# EAGLE schematic quantum_AnalougeEngine_V5_0 (EAGLE 9.5.2)

## Sheet 1 of 12: Voltages
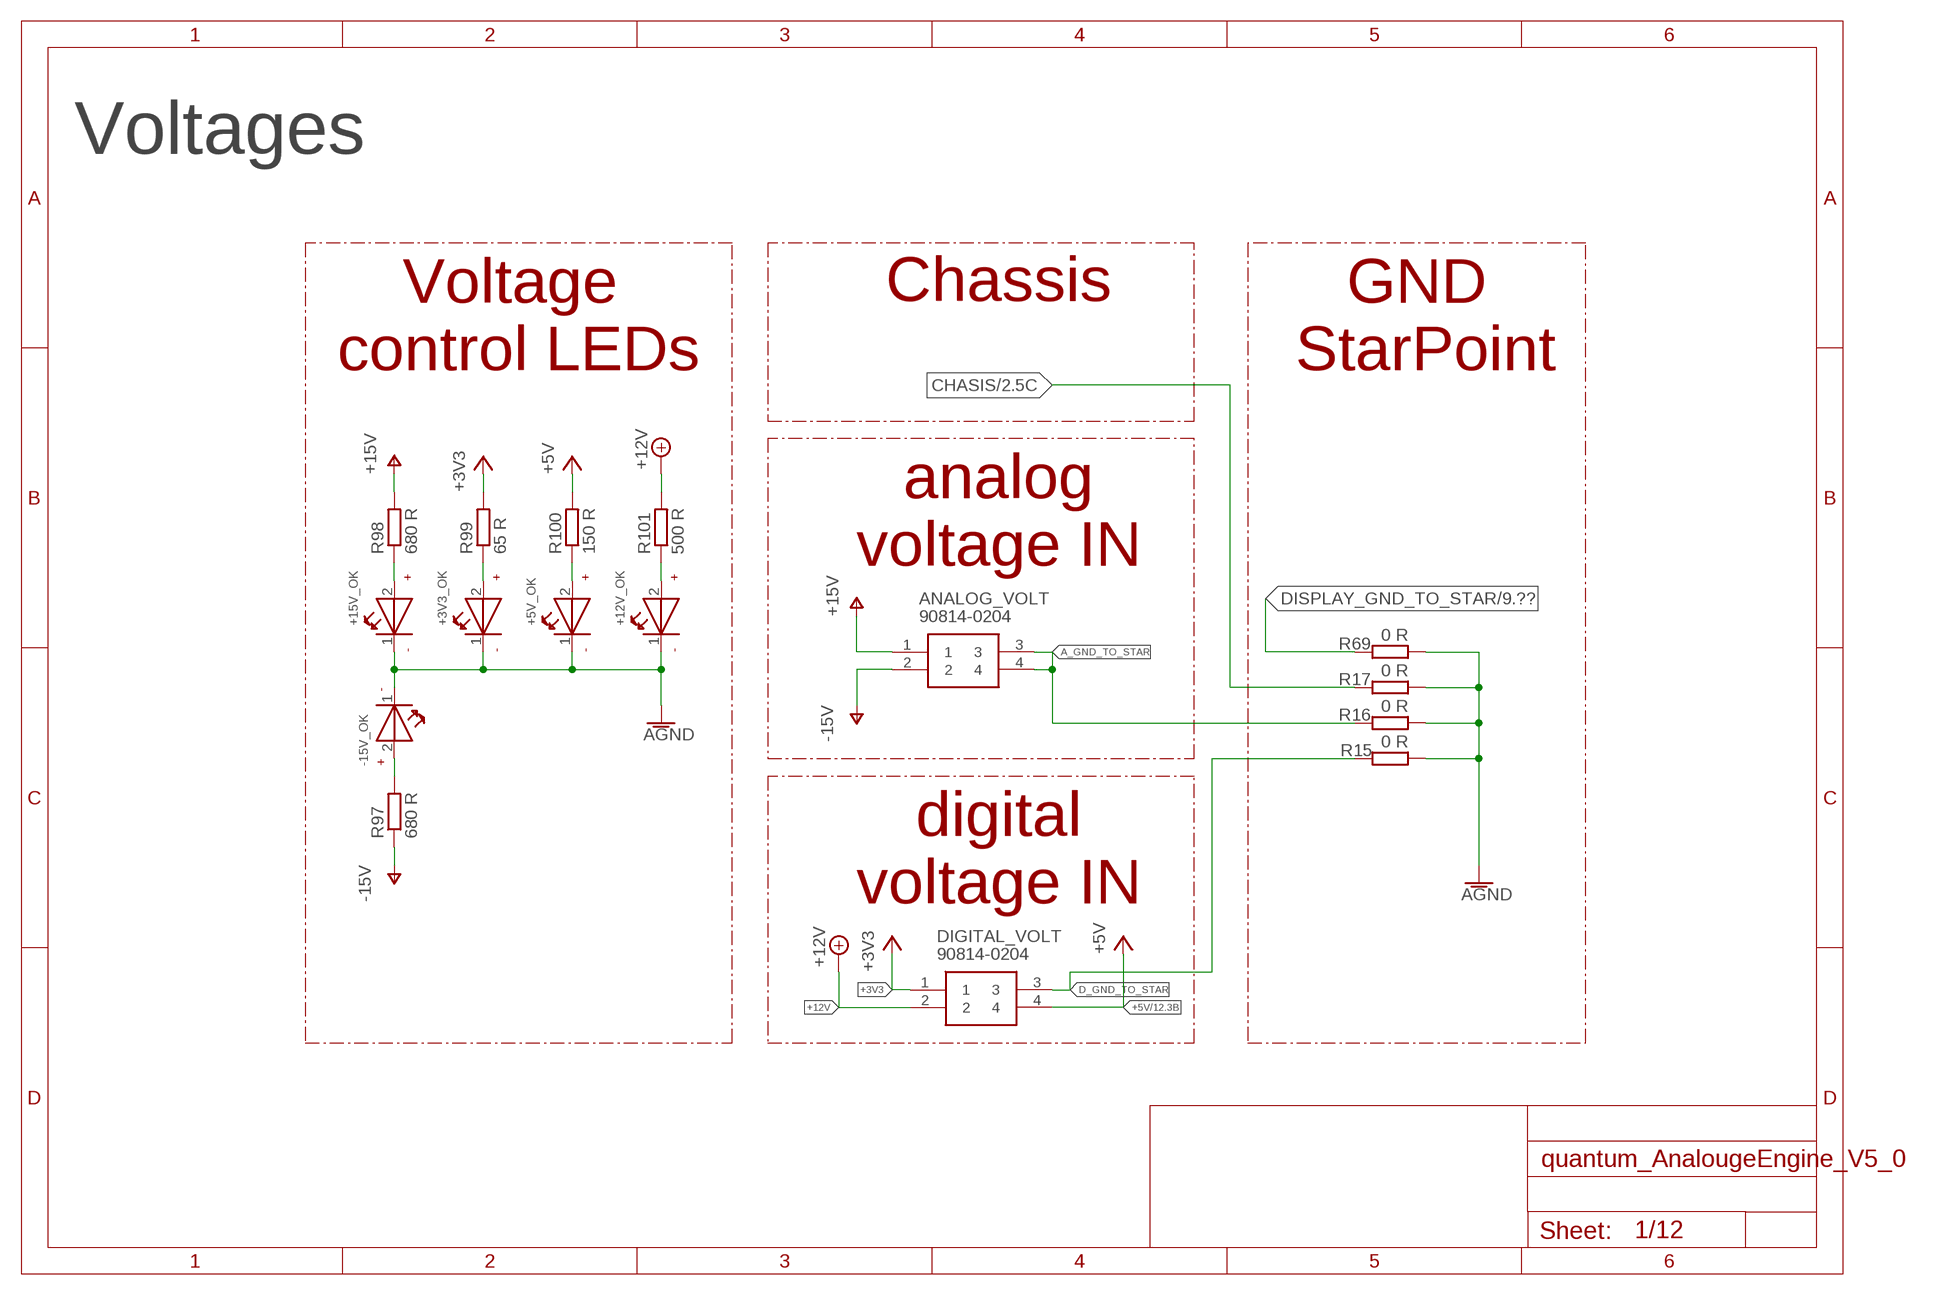
[diagram p0: schematic, sheet 1]

### Parts
+3V3_OK  LED_GREEN_SMD  [WL-SMCW_0603]
+5V_OK  LED_GREEN_SMD  [WL-SMCW_0603]
+12V_OK  LED_GREEN_SMD  [WL-SMCW_0603]
+15V_OK  LED_GREEN_SMD  [WL-SMCW_0603]
-15V_OK  LED_GREEN_SMD  [WL-SMCW_0603]
ANALOG_VOLT  90814-0204  [MOLEX_90814-0204]
DIGITAL_VOLT  90814-0204  [MOLEX_90814-0204]
R15  0 R  RESISTOR_0603  [R0603]
R16  0 R  RESISTOR_0603  [R0603]
R17  0 R  RESISTOR_0603  [R0603]
R69  0 R  RESISTOR_0603  [R0603]
R97  680 R  RESISTOR_0603  [R0603]
R98  680 R  RESISTOR_0603  [R0603]
R99  65 R  RESISTOR_0603  [R0603]
R100  150 R  RESISTOR_0603  [R0603]
R101  500 R  RESISTOR_0603  [R0603]

### Nets
+3V3: DIGITAL_VOLT.1 R99.2 ; also sheet 9,10,11
+5V: DIGITAL_VOLT.4 R100.2 ; also sheet 9,11,12
+12V: DIGITAL_VOLT.2 R101.2 ; also sheet 3,11
A_GND_TO_STAR: ANALOG_VOLT.3 ANALOG_VOLT.4 R16.1
AGND: +3V3_OK.1(-) +5V_OK.1(-) +12V_OK.1(-) +15V_OK.1(-) -15V_OK.1(-) R15.2 R16.2 R17.2 R69.2 ; also sheet 2,3,4,5,6,7,8,9,10,11,12
CHASIS: R17.1 ; also sheet 2,4,9,10
D_GND_TO_STAR: DIGITAL_VOLT.3 R15.1
DISPLAY_GND_TO_STAR: R69.1 ; also sheet 9
N$76: -15V_OK.2(+) R97.2
N$82: +15V_OK.2(+) R98.1
N$83: +3V3_OK.2(+) R99.1
N$84: +5V_OK.2(+) R100.1
N$85: +12V_OK.2(+) R101.1
V+: ANALOG_VOLT.1 R98.2 ; supply symbol labelled +15V ; also sheet 2,4,5,6,7,8,11,12
V-: ANALOG_VOLT.2 R97.1 ; supply symbol labelled -15V ; also sheet 2,4,5,6,7,8,11,12

### Notes on the sheet
- Voltages
- Chassis
- Voltage 
  control LEDs
- GND 
  StarPoint
- analog
  voltage IN
- digital
  voltage IN

## Sheet 2 of 12: Right I/O Section
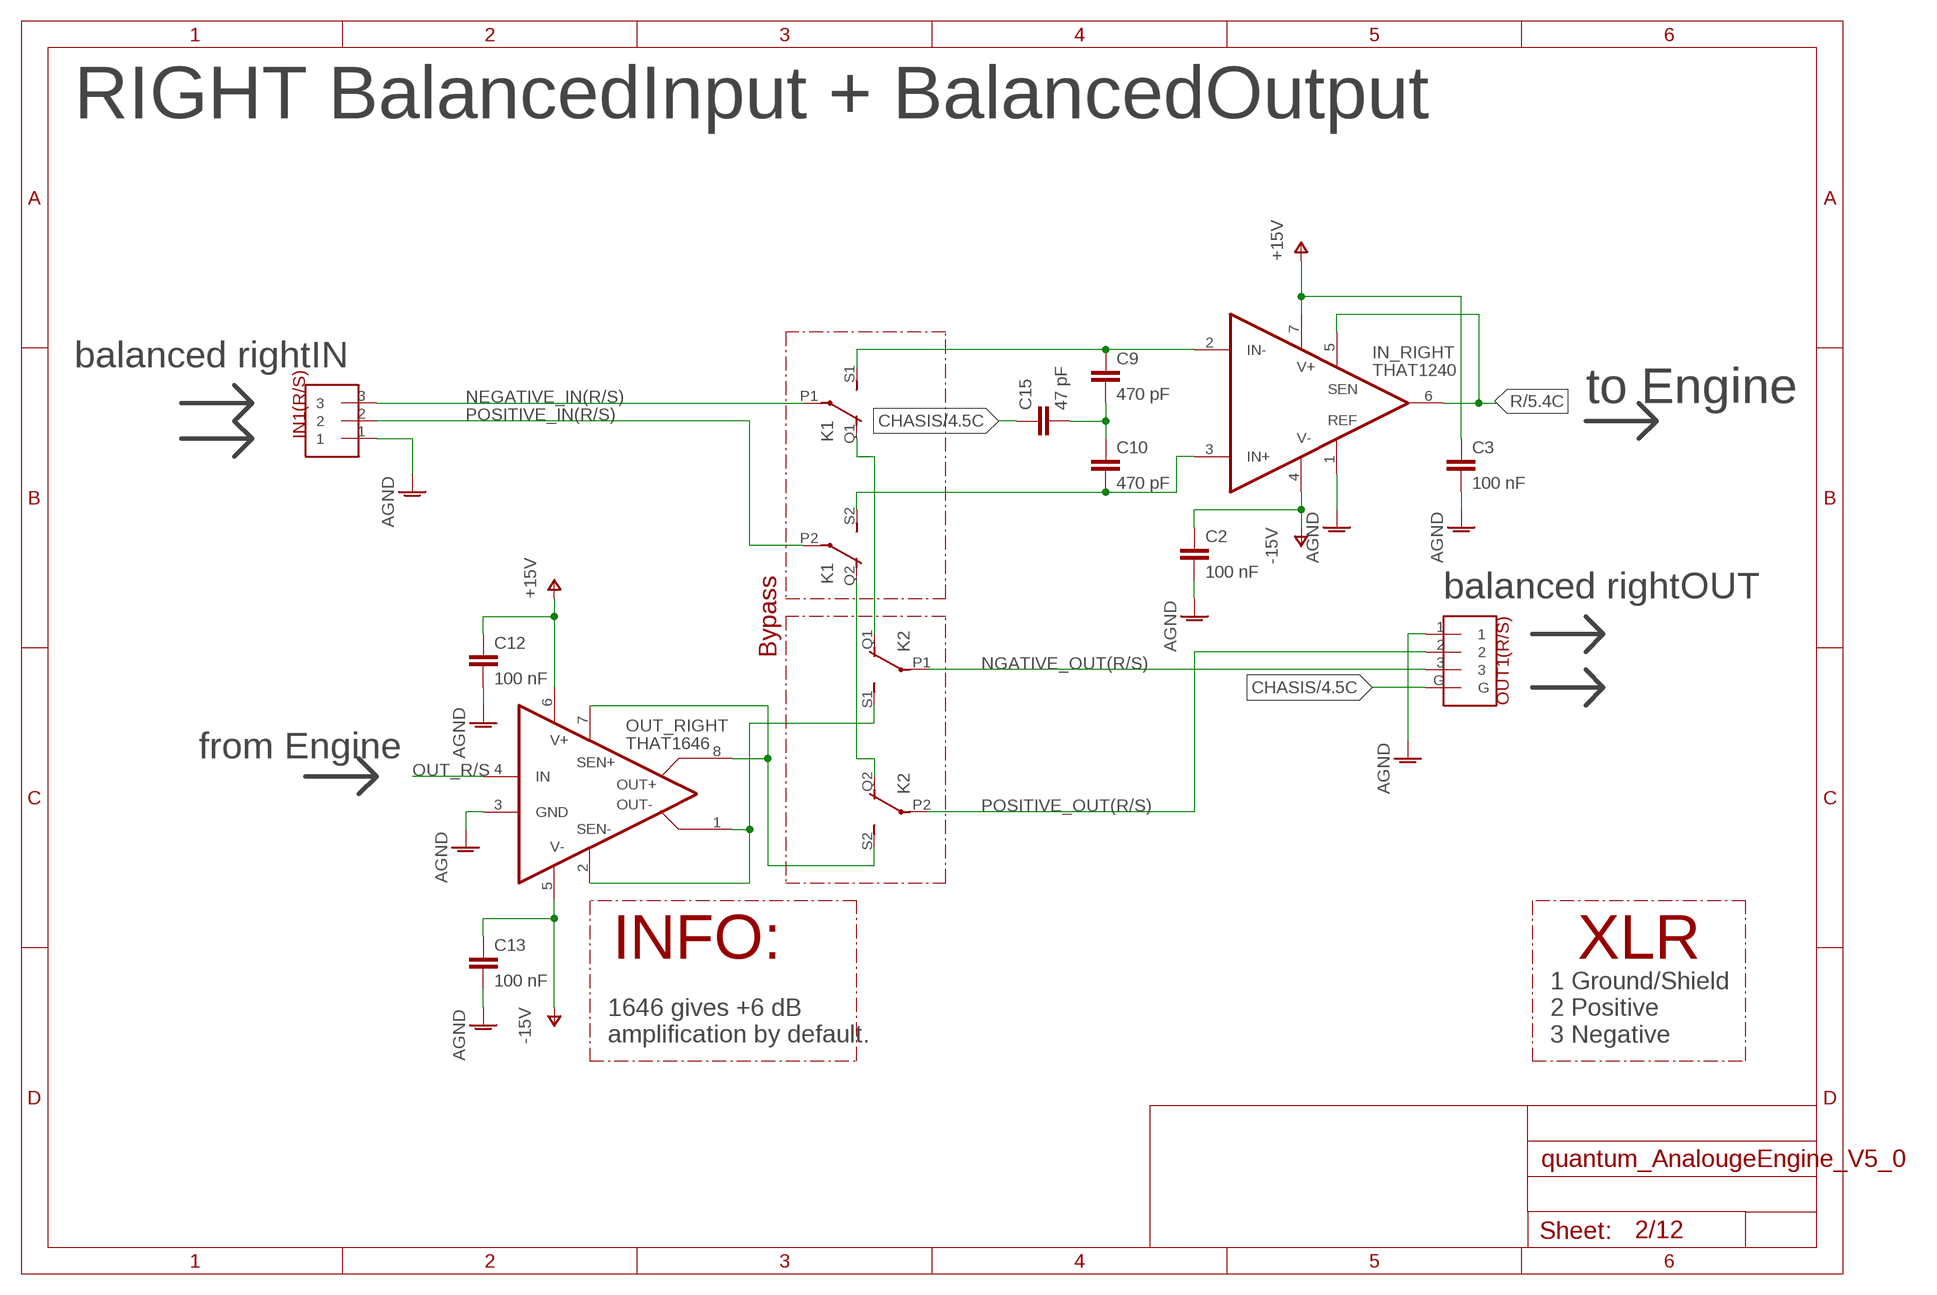
[diagram p1: schematic, sheet 2]

### Parts
C2  100 nF  CAPACITOR_0603  [C0603]
C3  100 nF  CAPACITOR_0603  [C0603]
C9  470 pF  CAPACITOR_0603  [C0603]
C10  470 pF  CAPACITOR_0603  [C0603]
C12  100 nF  CAPACITOR_0603  [C0603]
C13  100 nF  CAPACITOR_0603  [C0603]
C15  47 pF  CAPACITOR_0603  [C0603]
IN1(R/S)  NEUTRIK_NC3FAH  [NEUTRIK_NC3FAH]
IN_RIGHT  THAT1240  THAT1240SO8-USO8-U  [SO08]
K1  Relay  RELAY_EE2-5NU  [351]
K2  Relay  RELAY_EE2-5NU  [351]
OUT1(R/S)  NEUTRIK_NC3MAH  [NEUTRIK_NC3MAH]
OUT_RIGHT  THAT1646  THAT1646SO8-USO8-U  [SO08]

### Nets
AGND: C2.2 C3.2 C12.2 C13.2 IN1(R/S).1 IN_RIGHT.1(REF) OUT1(R/S).1 OUT_RIGHT.3(GND) ; also sheet 1,3,4,5,6,7,8,9,10,11,12
CHASIS: C15.1 OUT1(R/S).G ; also sheet 1,4,9,10
N$1: C9.1 IN_RIGHT.2(IN-) K1.S1(2:S)
N$2: C10.2 IN_RIGHT.3(IN+) K1.S2(3:S)
N$3: C9.2 C10.1 C15.2
N$8: K1.Q1(2:O) K2.Q1(2:O)
N$11: K1.Q2(3:O) K2.Q2(3:O)
NEGATIVE_IN(R/S): IN1(R/S).3 K1.P1(2:P)
NGATIVE_OUT(R/S): K2.P1(2:P) OUT1(R/S).3
OUT_R/S: OUT_RIGHT.4(IN) ; also sheet 8
POSITIVE_IN(R/S): IN1(R/S).2 K1.P2(3:P)
POSITIVE_OUT(R/S): K2.P2(3:P) OUT1(R/S).2
R: IN_RIGHT.5(SEN) IN_RIGHT.6(OUT) ; also sheet 5
R/S_OUT+: K2.S2(3:S) OUT_RIGHT.7(SEN+) OUT_RIGHT.8(OUT+)
R/S_OUT-: K2.S1(2:S) OUT_RIGHT.1(OUT-) OUT_RIGHT.2(SEN-)
V+: C3.1 C12.1 IN_RIGHT.7(V+) OUT_RIGHT.6(V+) ; supply symbol labelled +15V ; also sheet 1,4,5,6,7,8,11,12
V-: C2.1 C13.1 IN_RIGHT.4(V-) OUT_RIGHT.5(V-) ; supply symbol labelled -15V ; also sheet 1,4,5,6,7,8,11,12

### Notes on the sheet
- RIGHT BalancedInput + BalancedOutput
- balanced rightIN
- to Engine
- balanced rightOUT
- Bypass
- from Engine
- INFO: | XLR
- 1646 gives +6 dB 
  amplification by default.
- 1 Ground/Shield
  2 Positive
  3 Negative

## Sheet 3 of 12: Relais
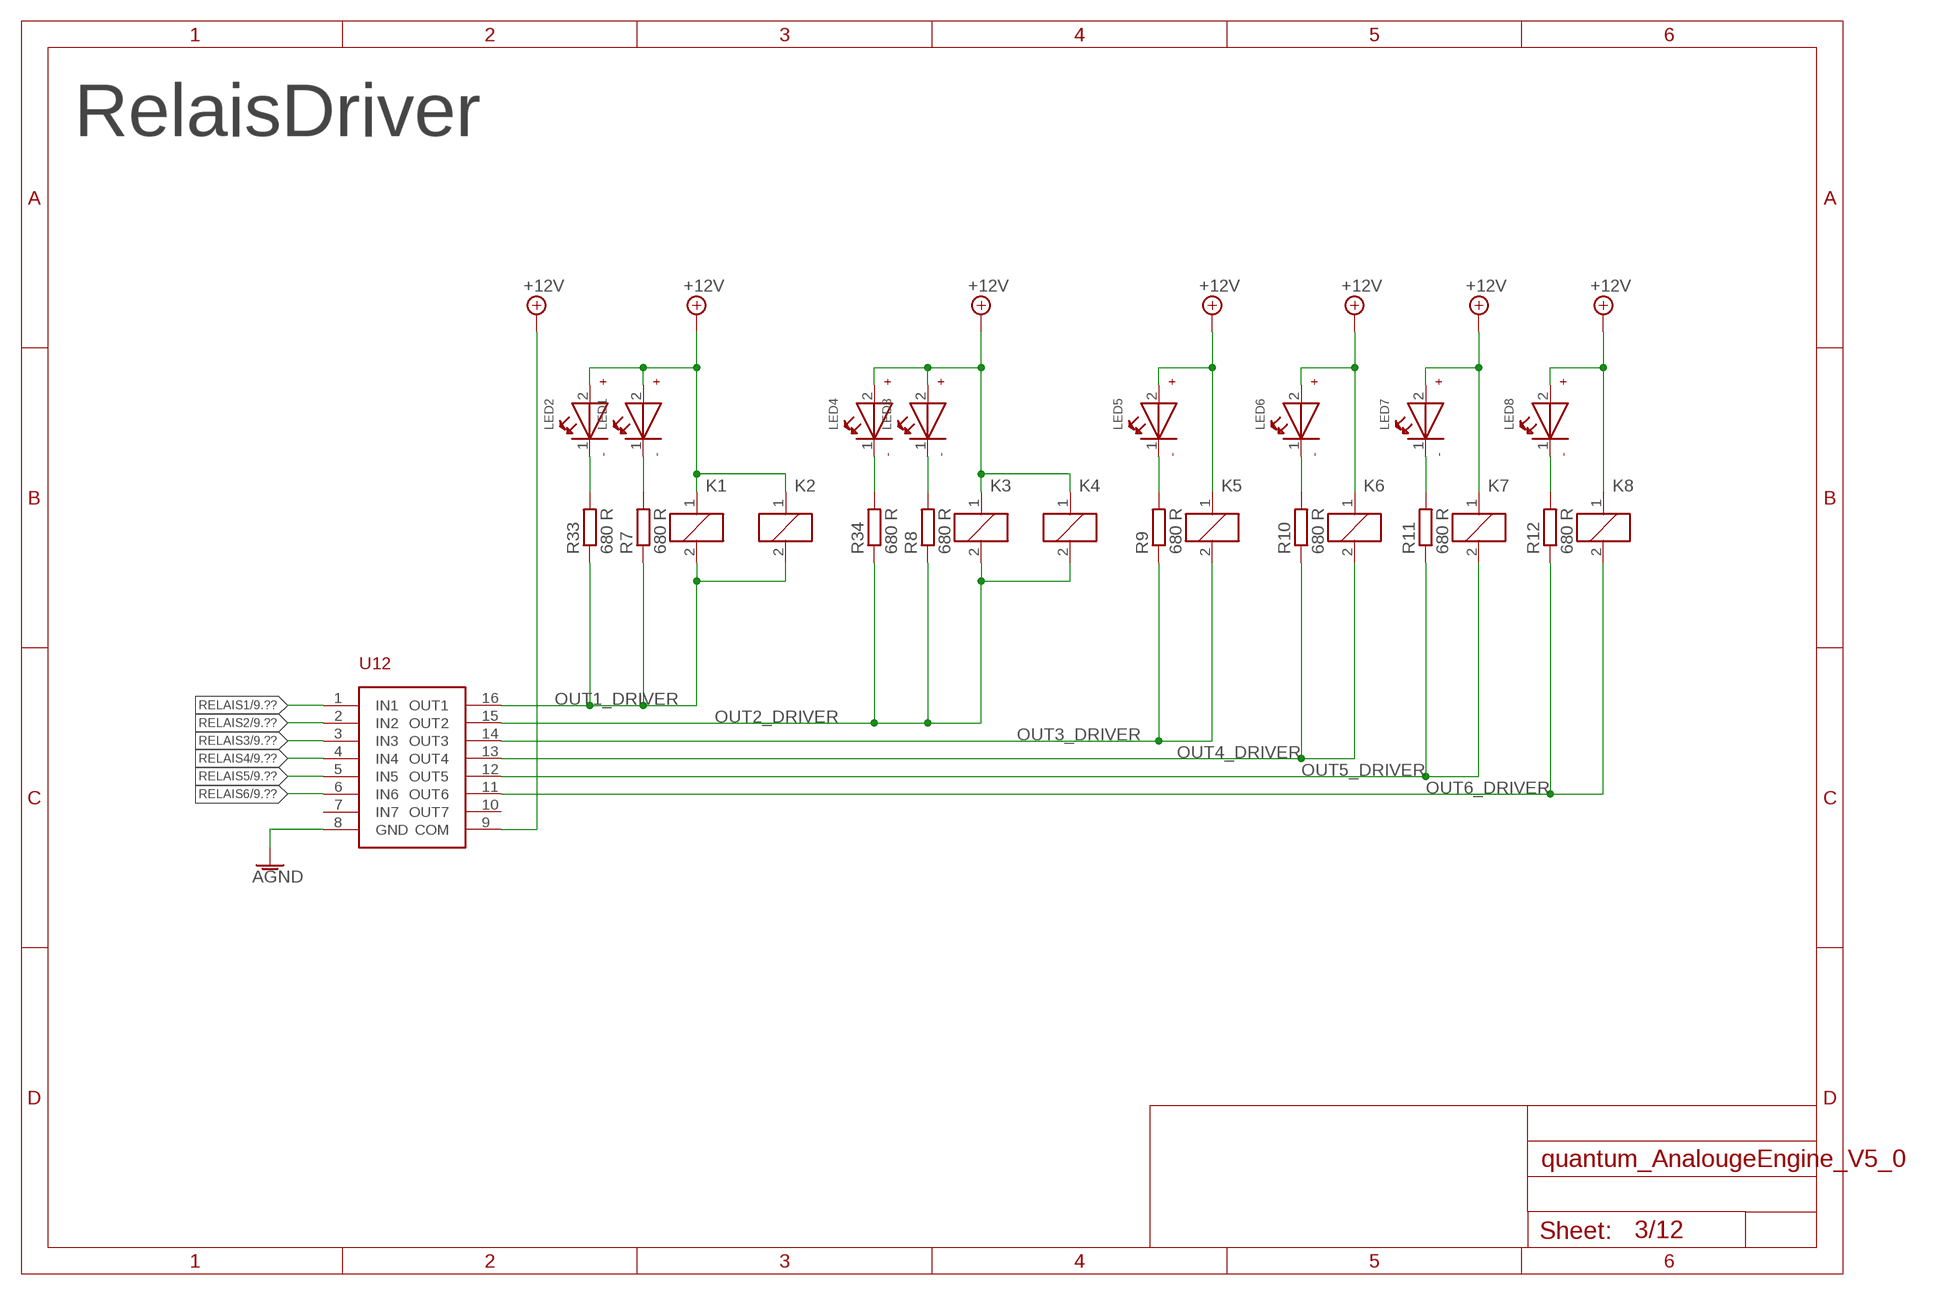
[diagram p2: schematic, sheet 3]

### Parts
K3  Relay  RELAY_EE2-5NU  [351]
K4  Relay  RELAY_EE2-5NU  [351]
K5  Relay  RELAY_EE2-5NU  [351]
K6  Relay  RELAY_EE2-5NU  [351]
K7  Relay  RELAY_EE2-5NU  [351]
K8  Relay  RELAY_EE2-5NU  [351]
LED1  LED_BLUE_SMD  [WL-SMCW_0603]
LED2  LED_BLUE_SMD  [WL-SMCW_0603]
LED3  LED_BLUE_SMD  [WL-SMCW_0603]
LED4  LED_BLUE_SMD  [WL-SMCW_0603]
LED5  LED_BLUE_SMD  [WL-SMCW_0603]
LED6  LED_BLUE_SMD  [WL-SMCW_0603]
LED7  LED_BLUE_SMD  [WL-SMCW_0603]
LED8  LED_BLUE_SMD  [WL-SMCW_0603]
R7  680 R  RESISTOR_0603  [R0603]
R8  680 R  RESISTOR_0603  [R0603]
R9  680 R  RESISTOR_0603  [R0603]
R10  680 R  RESISTOR_0603  [R0603]
R11  680 R  RESISTOR_0603  [R0603]
R12  680 R  RESISTOR_0603  [R0603]
R33  680 R  RESISTOR_0603  [R0603]
R34  680 R  RESISTOR_0603  [R0603]
U12  ULN2003  [SOIC16]

### Nets
+12V: K1.1 K2.1 K3.1 K4.1 K5.1 K6.1 K7.1 K8.1 LED1.2(+) LED2.2(+) LED3.2(+) LED4.2(+) LED5.2(+) LED6.2(+) LED7.2(+) LED8.2(+) U12.9(COM) ; also sheet 1,11
AGND: U12.8(GND) ; also sheet 1,2,4,5,6,7,8,9,10,11,12
N$14: LED1.1(-) R7.2
N$16: LED3.1(-) R8.2
N$26: LED8.1(-) R12.2
N$29: LED7.1(-) R11.2
N$30: LED6.1(-) R10.2
N$32: LED5.1(-) R9.2
N$49: LED2.1(-) R33.2
N$51: LED4.1(-) R34.2
OUT1_DRIVER: K1.2 K2.2 R7.1 R33.1 U12.16(OUT1)
OUT2_DRIVER: K3.2 K4.2 R8.1 R34.1 U12.15(OUT2)
OUT3_DRIVER: K5.2 R9.1 U12.14(OUT3)
OUT4_DRIVER: K6.2 R10.1 U12.13(OUT4)
OUT5_DRIVER: K7.2 R11.1 U12.12(OUT5)
OUT6_DRIVER: K8.2 R12.1 U12.11(OUT6)
RELAIS1: U12.1(IN1) ; also sheet 9
RELAIS2: U12.2(IN2) ; also sheet 9
RELAIS3: U12.3(IN3) ; also sheet 9
RELAIS4: U12.4(IN4) ; also sheet 9
RELAIS5: U12.5(IN5) ; also sheet 9
RELAIS6: U12.6(IN6) ; also sheet 9
Unconnected: U12.7(IN7) U12.10(OUT7)

### Notes on the sheet
- RelaisDriver

## Sheet 4 of 12: Left I/O Section
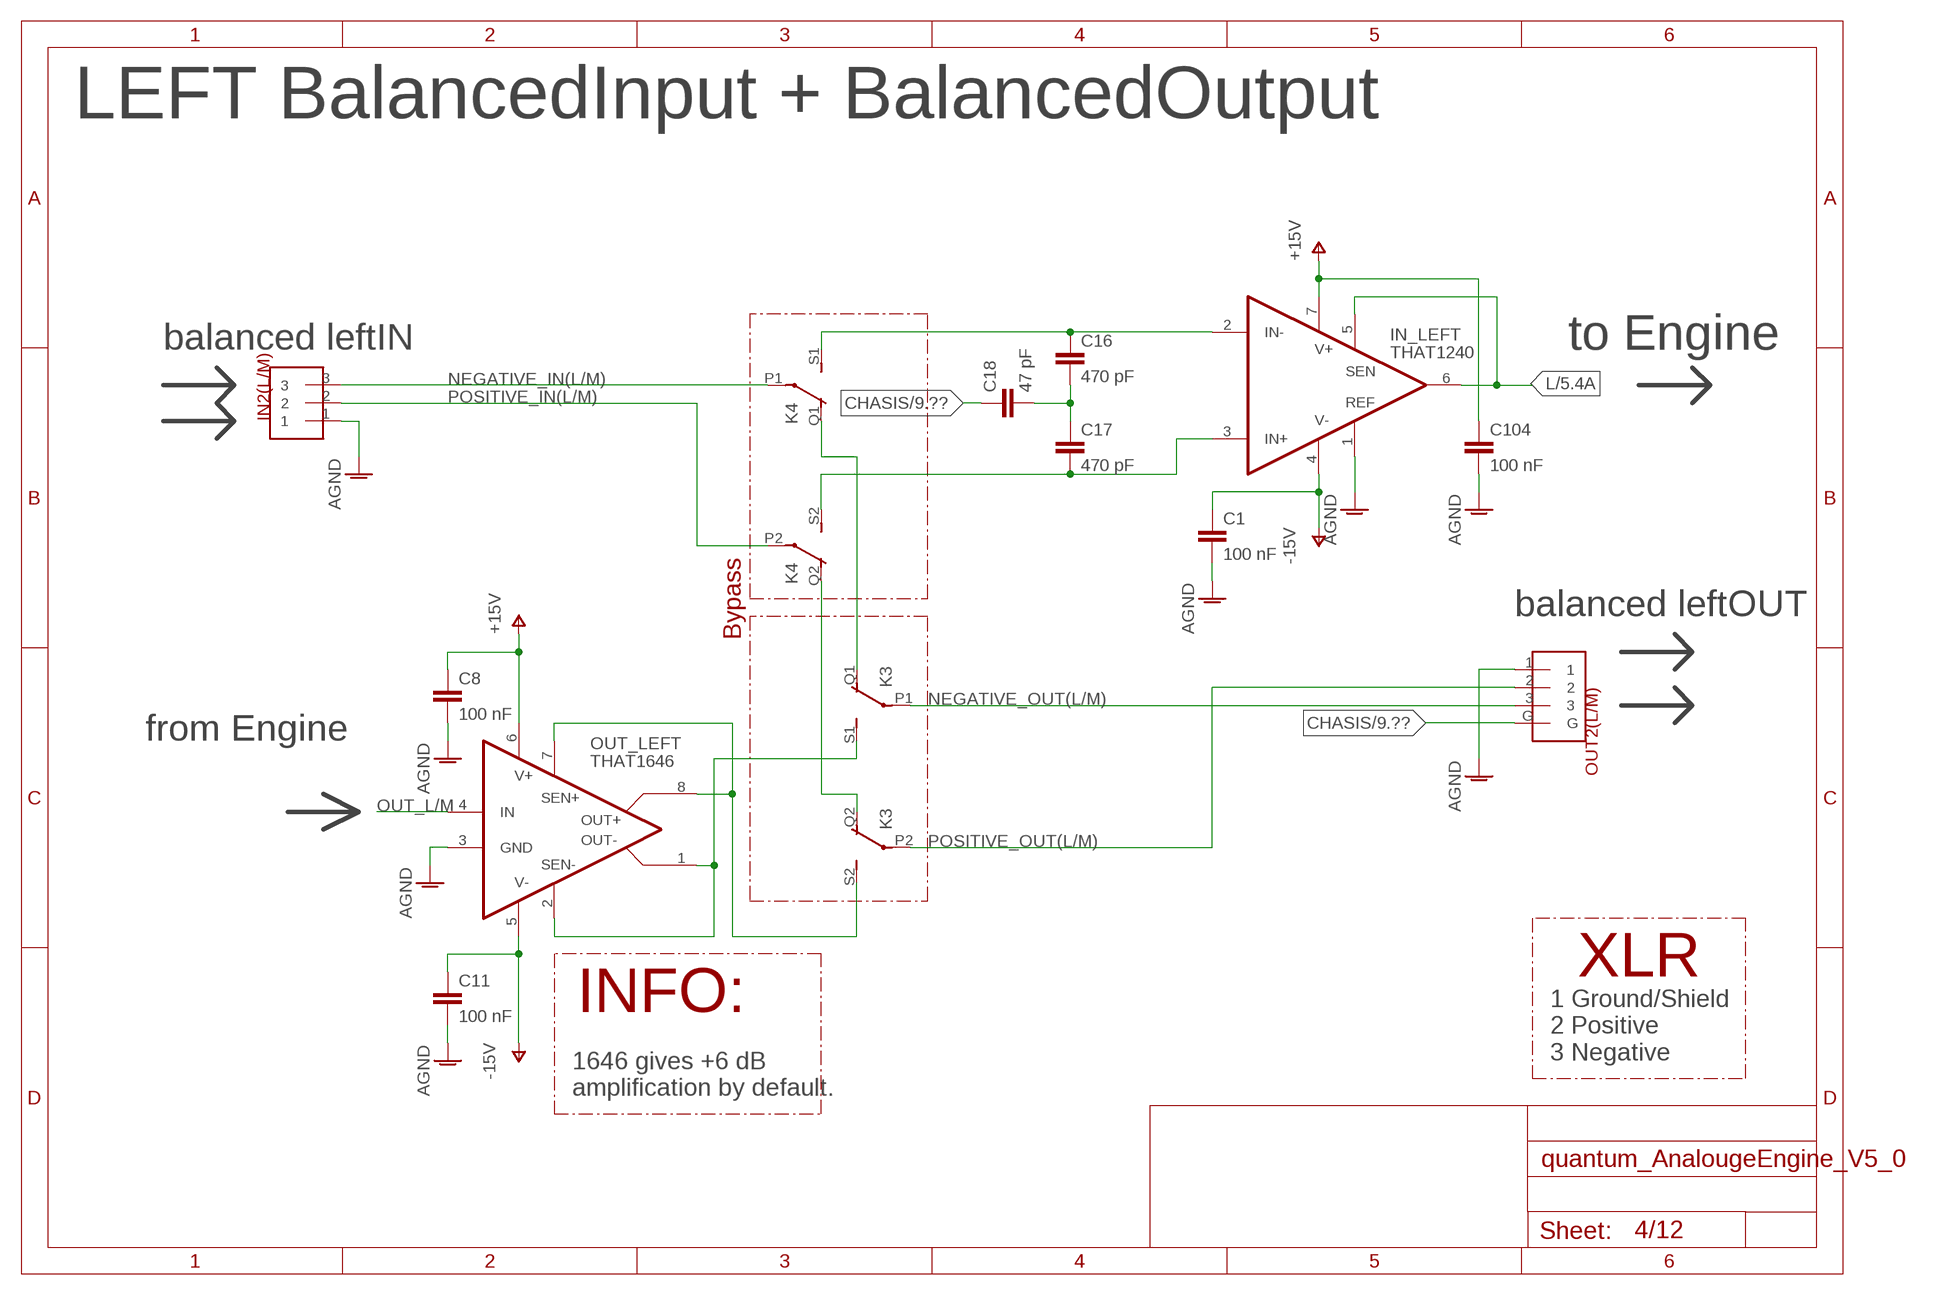
[diagram p3: schematic, sheet 4]

### Parts
C1  100 nF  CAPACITOR_0603  [C0603]
C8  100 nF  CAPACITOR_0603  [C0603]
C11  100 nF  CAPACITOR_0603  [C0603]
C16  470 pF  CAPACITOR_0603  [C0603]
C17  470 pF  CAPACITOR_0603  [C0603]
C18  47 pF  CAPACITOR_0603  [C0603]
C104  100 nF  CAPACITOR_0603  [C0603]
IN2(L/M)  NEUTRIK_NC3FAH  [NEUTRIK_NC3FAH]
IN_LEFT  THAT1240  THAT1240SO8-USO8-U  [SO08]
OUT2(L/M)  NEUTRIK_NC3MAH  [NEUTRIK_NC3MAH]
OUT_LEFT  THAT1646  THAT1646SO8-USO8-U  [SO08]

### Nets
AGND: C1.2 C8.2 C11.2 C104.2 IN2(L/M).1 IN_LEFT.1(REF) OUT2(L/M).1 OUT_LEFT.3(GND) ; also sheet 1,2,3,5,6,7,8,9,10,11,12
CHASIS: C18.1 OUT2(L/M).G ; also sheet 1,2,9,10
L: IN_LEFT.5(SEN) IN_LEFT.6(OUT) ; also sheet 5
L/M_OUT+: K3.S2(3:S) OUT_LEFT.7(SEN+) OUT_LEFT.8(OUT+)
L/M_OUT-: K3.S1(2:S) OUT_LEFT.1(OUT-) OUT_LEFT.2(SEN-)
N$7: C17.2 IN_LEFT.3(IN+) K4.S2(3:S)
N$9: C16.2 C17.1 C18.2
N$13: C16.1 IN_LEFT.2(IN-) K4.S1(2:S)
N$28: K3.Q1(2:O) K4.Q1(2:O)
N$31: K3.Q2(3:O) K4.Q2(3:O)
NEGATIVE_IN(L/M): IN2(L/M).3 K4.P1(2:P)
NEGATIVE_OUT(L/M): K3.P1(2:P) OUT2(L/M).3
OUT_L/M: OUT_LEFT.4(IN) ; also sheet 8
POSITIVE_IN(L/M): IN2(L/M).2 K4.P2(3:P)
POSITIVE_OUT(L/M): K3.P2(3:P) OUT2(L/M).2
V+: C8.1 C104.1 IN_LEFT.7(V+) OUT_LEFT.6(V+) ; supply symbol labelled +15V ; also sheet 1,2,5,6,7,8,11,12
V-: C1.1 C11.1 IN_LEFT.4(V-) OUT_LEFT.5(V-) ; supply symbol labelled -15V ; also sheet 1,2,5,6,7,8,11,12

### Notes on the sheet
- LEFT BalancedInput + BalancedOutput
- balanced leftIN | to Engine
- Bypass
- balanced leftOUT
- from Engine
- XLR
- INFO:
- 1 Ground/Shield
  2 Positive
  3 Negative
- 1646 gives +6 dB 
  amplification by default.

## Sheet 5 of 12: MS Encode
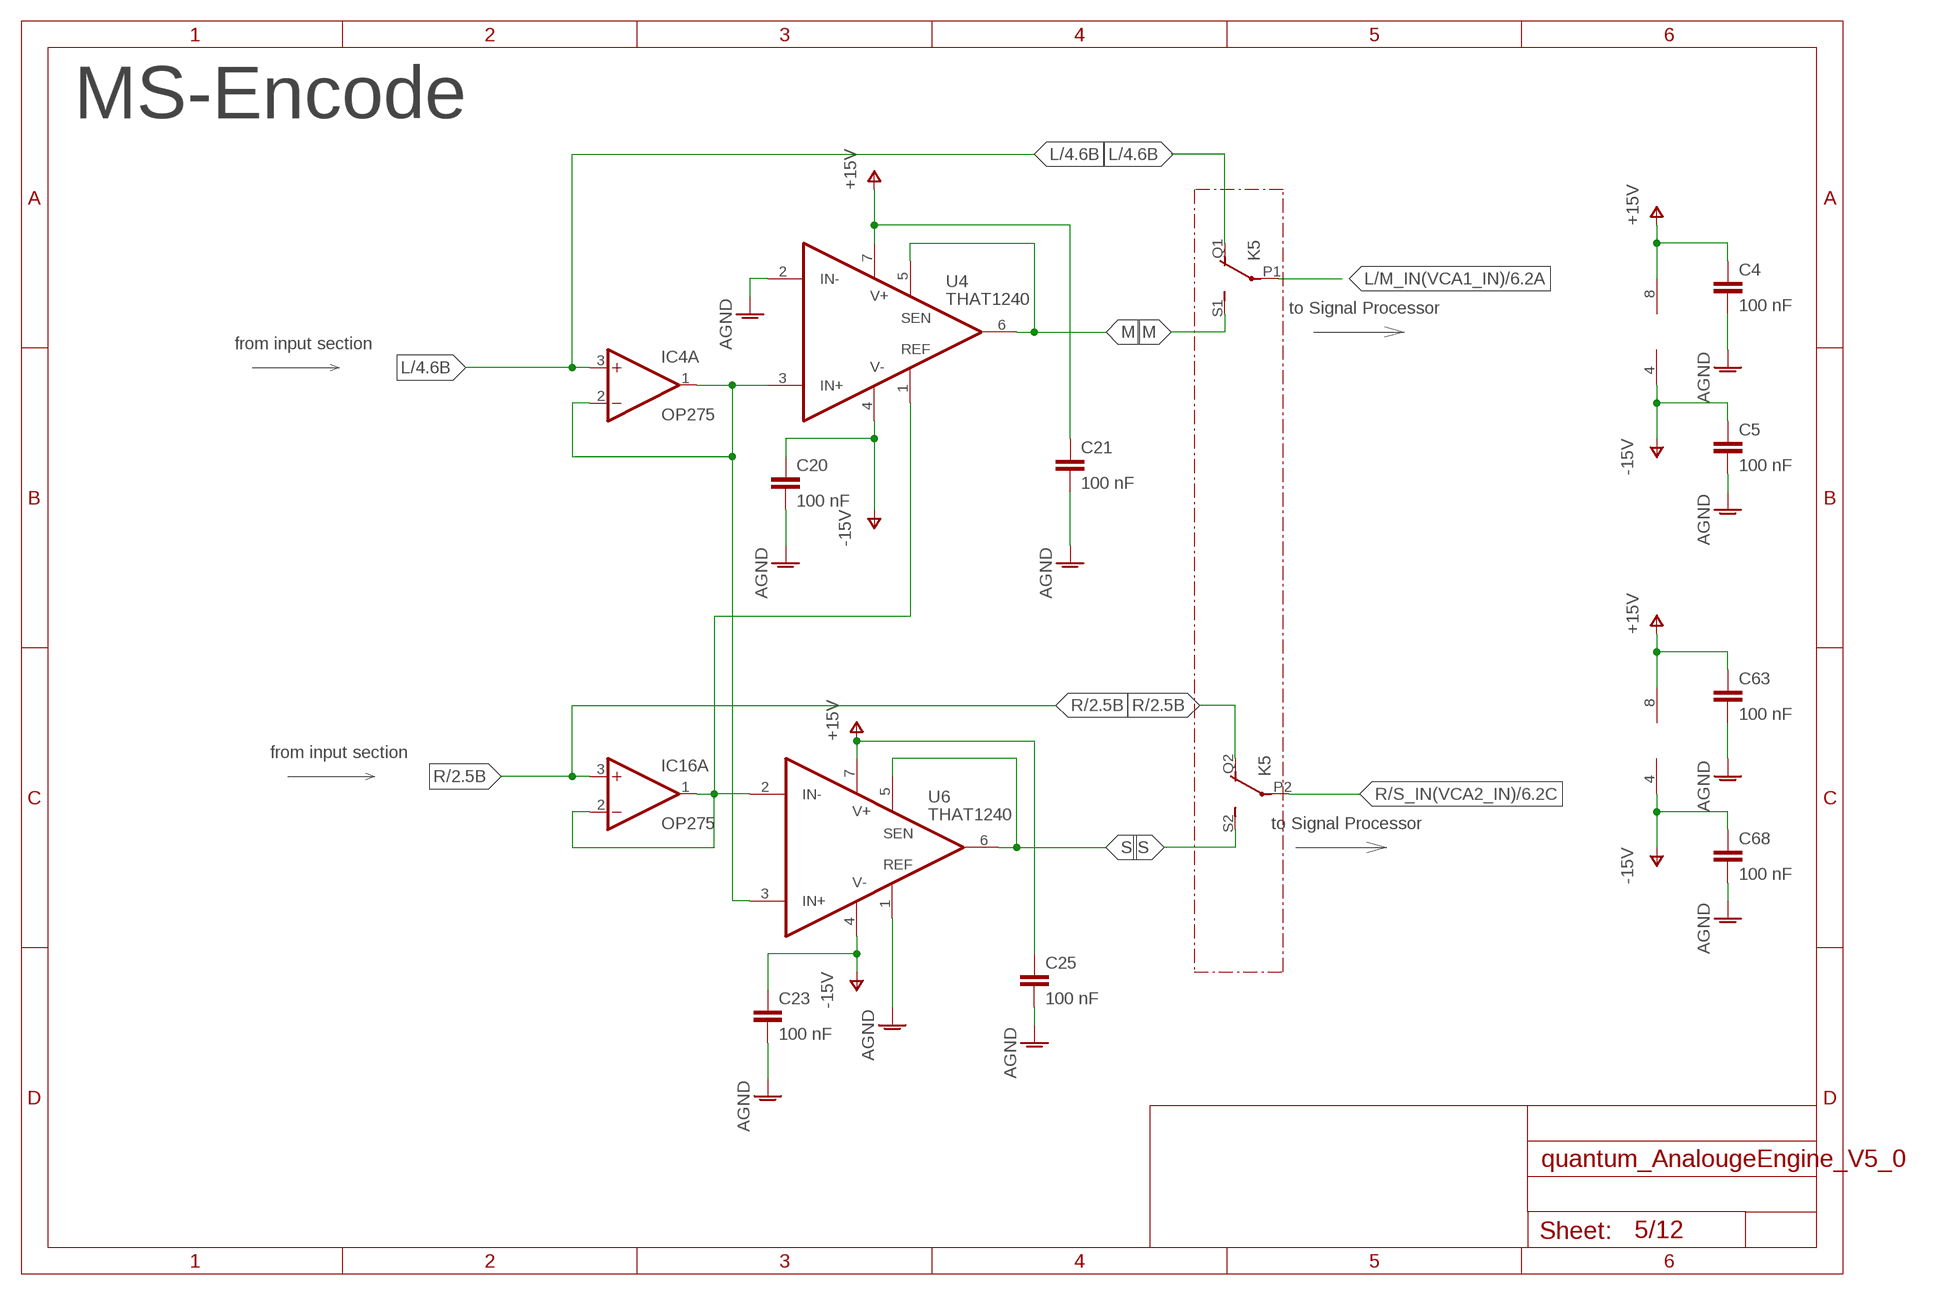
[diagram p4: schematic, sheet 5]

### Parts
C4  100 nF  CAPACITOR_0603  [C0603]
C5  100 nF  CAPACITOR_0603  [C0603]
C20  100 nF  CAPACITOR_0603  [C0603]
C21  100 nF  CAPACITOR_0603  [C0603]
C23  100 nF  CAPACITOR_0603  [C0603]
C25  100 nF  CAPACITOR_0603  [C0603]
C63  100 nF  CAPACITOR_0603  [C0603]
C68  100 nF  CAPACITOR_0603  [C0603]
IC4  OP275  [SOIC8]
IC16  OP275  [SOIC8]
U4  THAT1240  THAT1240SO8-USO8-U  [SO08]
U6  THAT1240  THAT1240SO8-USO8-U  [SO08]

### Nets
AGND: C4.2 C5.2 C20.2 C21.2 C23.2 C25.2 C63.2 C68.2 U4.2(IN-) U6.1(REF) ; also sheet 1,2,3,4,6,7,8,9,10,11,12
L: IC4.3(A:+IN) K5.Q1(2:O) ; also sheet 4
L/M_IN(VCA1_IN): K5.P1(2:P) ; also sheet 6,11
M: K5.S1(2:S) U4.5(SEN) U4.6(OUT)
N$18: IC4.1(A:OUT) IC4.2(A:-IN) U4.3(IN+) U6.3(IN+)
N$33: IC16.1(A:OUT) IC16.2(A:-IN) U4.1(REF) U6.2(IN-)
R: IC16.3(A:+IN) K5.Q2(3:O) ; also sheet 2
R/S_IN(VCA2_IN): K5.P2(3:P) ; also sheet 6,11
S: K5.S2(3:S) U6.5(SEN) U6.6(OUT)
V+: C4.1 C21.1 C25.1 C63.1 IC4.8(P:V+) IC16.8(P:V+) U4.7(V+) U6.7(V+) ; supply symbol labelled +15V ; also sheet 1,2,4,6,7,8,11,12
V-: C5.1 C20.1 C23.1 C68.1 IC4.4(P:V-) IC16.4(P:V-) U4.4(V-) U6.4(V-) ; supply symbol labelled -15V ; also sheet 1,2,4,6,7,8,11,12
Unconnected: IC4.5(B:+IN) IC4.6(B:-IN) IC4.7(B:OUT) IC16.5(B:+IN) IC16.6(B:-IN) IC16.7(B:OUT)

### Notes on the sheet
- MS-Encode
- to Signal Processor
- from input section
- from input section
- to Signal Processor

## Sheet 6 of 12: VCA
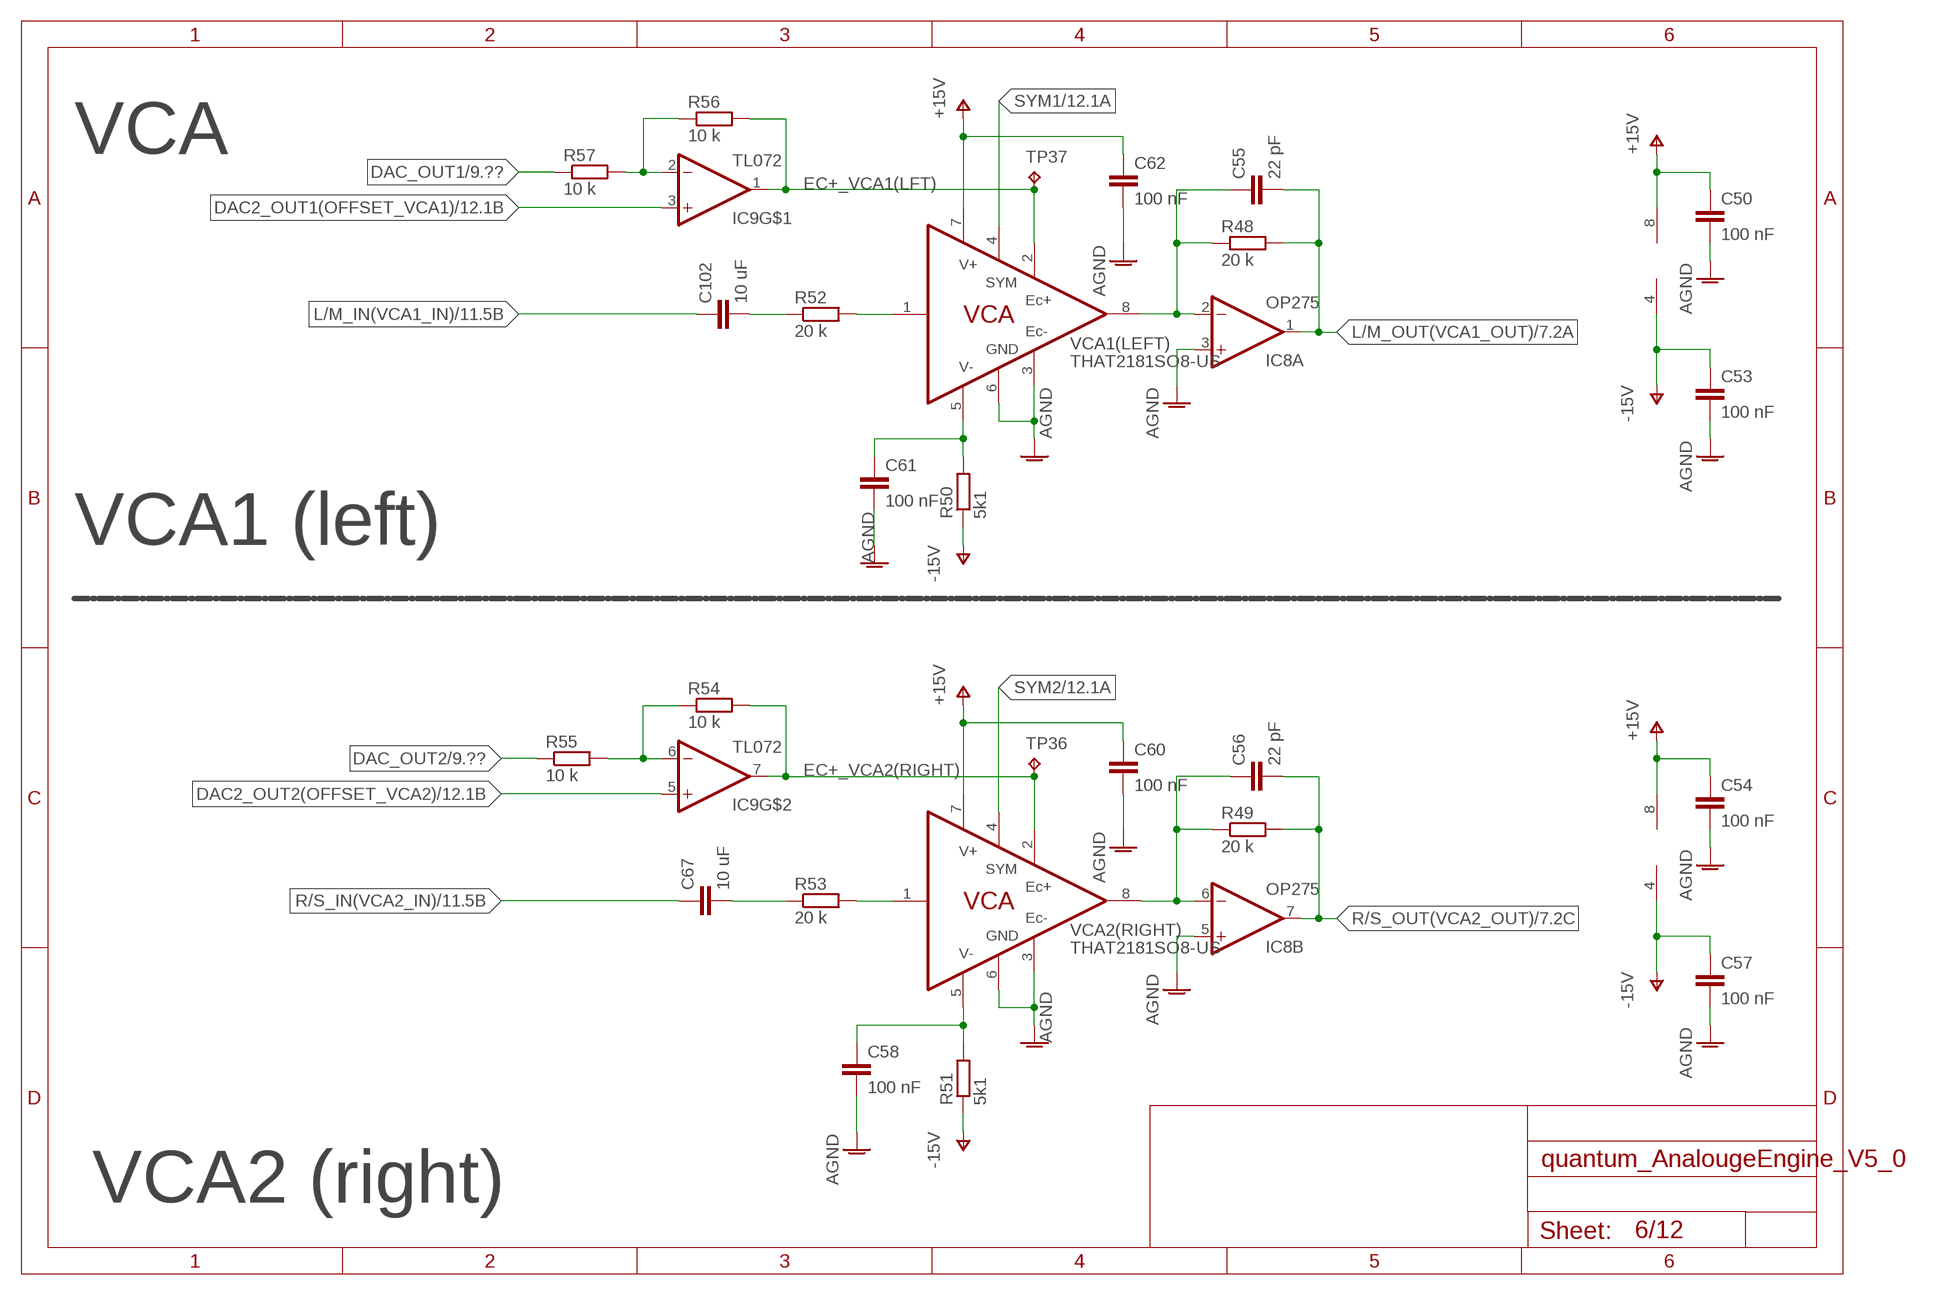
[diagram p5: schematic, sheet 6]

### Parts
C50  100 nF  CAPACITOR_0603  [C0603]
C53  100 nF  CAPACITOR_0603  [C0603]
C54  100 nF  CAPACITOR_0603  [C0603]
C55  22 pF  CAPACITOR_0603  [C0603]
C56  22 pF  CAPACITOR_0603  [C0603]
C57  100 nF  CAPACITOR_0603  [C0603]
C58  100 nF  CAPACITOR_0603  [C0603]
C60  100 nF  CAPACITOR_0603  [C0603]
C61  100 nF  CAPACITOR_0603  [C0603]
C62  100 nF  CAPACITOR_0603  [C0603]
C67  10 uF  CAPACITOR_1206  [C1206]
C102  10 uF  CAPACITOR_1206  [C1206]
IC8  OP275  [SOIC8]
IC9  TL072  [SOIC8]
R48  20 k  RESISTOR_0603  [R0603]
R49  20 k  RESISTOR_0603  [R0603]
R50  5k1  RESISTOR_0603  [R0603]
R51  5k1  RESISTOR_0603  [R0603]
R52  20 k  RESISTOR_0603  [R0603]
R53  20 k  RESISTOR_0603  [R0603]
R54  10 k  RESISTOR_0603  [R0603]
R55  10 k  RESISTOR_0603  [R0603]
R56  10 k  RESISTOR_0603  [R0603]
R57  10 k  RESISTOR_0603  [R0603]
TP36  TPTHT  [THT_PIN]
TP37  TPTHT  [THT_PIN]
VCA1(LEFT)  THAT2181SO8-US  [SO08]
VCA2(RIGHT)  THAT2181SO8-US  [SO08]

### Nets
AGND: C50.2 C53.2 C54.2 C57.2 C58.2 C60.2 C61.2 C62.2 IC8.3(A:+IN) IC8.5(B:+IN) VCA1(LEFT).3(EC-) VCA1(LEFT).6(GND) VCA2(RIGHT).3(EC-) VCA2(RIGHT).6(GND) ; also sheet 1,2,3,4,5,7,8,9,10,11,12
DAC2_OUT1(OFFSET_VCA1): IC9.3(+IN) ; also sheet 12
DAC2_OUT2(OFFSET_VCA2): IC9.5(+IN) ; also sheet 12
DAC_OUT1: R57.1 ; also sheet 9
DAC_OUT2: R55.1 ; also sheet 9
EC+_VCA1(LFT): IC9.1(OUT) R56.2 TP37.P$1(TP) VCA1(LEFT).2(EC+)
EC+_VCA2(RIGHT): IC9.7(OUT) R54.2 TP36.P$1(TP) VCA2(RIGHT).2(EC+)
L/M_IN(VCA1_IN): C102.1 ; also sheet 5,11
L/M_OUT(VCA1_OUT): C55.2 IC8.1(A:OUT) R48.2 ; also sheet 7,11
N$63: IC9.2(-IN) R56.1 R57.2
N$64: C55.1 IC8.2(A:-IN) R48.1 VCA1(LEFT).8(OUT)
N$65: R52.2 VCA1(LEFT).1(IN)
N$71: C102.2 R52.1
N$75: C56.1 IC8.6(B:-IN) R49.1 VCA2(RIGHT).8(OUT)
N$77: C58.1 R51.2 VCA2(RIGHT).5(V-)
N$78: C67.2 R53.1
N$79: R53.2 VCA2(RIGHT).1(IN)
N$80: C61.1 R50.2 VCA1(LEFT).5(V-)
N$81: IC9.6(-IN) R54.1 R55.2
R/S_IN(VCA2_IN): C67.1 ; also sheet 5,11
R/S_OUT(VCA2_OUT): C56.2 IC8.7(B:OUT) R49.2 ; also sheet 7,11
SYM1: VCA1(LEFT).4(SYM) ; also sheet 12
SYM2: VCA2(RIGHT).4(SYM) ; also sheet 12
V+: C50.1 C54.1 C60.1 C62.1 IC8.8(P:V+) IC9.8(V+) VCA1(LEFT).7(V+) VCA2(RIGHT).7(V+) ; supply symbol labelled +15V ; also sheet 1,2,4,5,7,8,11,12
V-: C53.1 C57.1 IC8.4(P:V-) IC9.4(V-) R50.1 R51.1 ; supply symbol labelled -15V ; also sheet 1,2,4,5,7,8,11,12

### Notes on the sheet
- VCA
- VCA1 (left)
- VCA2 (right)

## Sheet 7 of 12: Output Stage
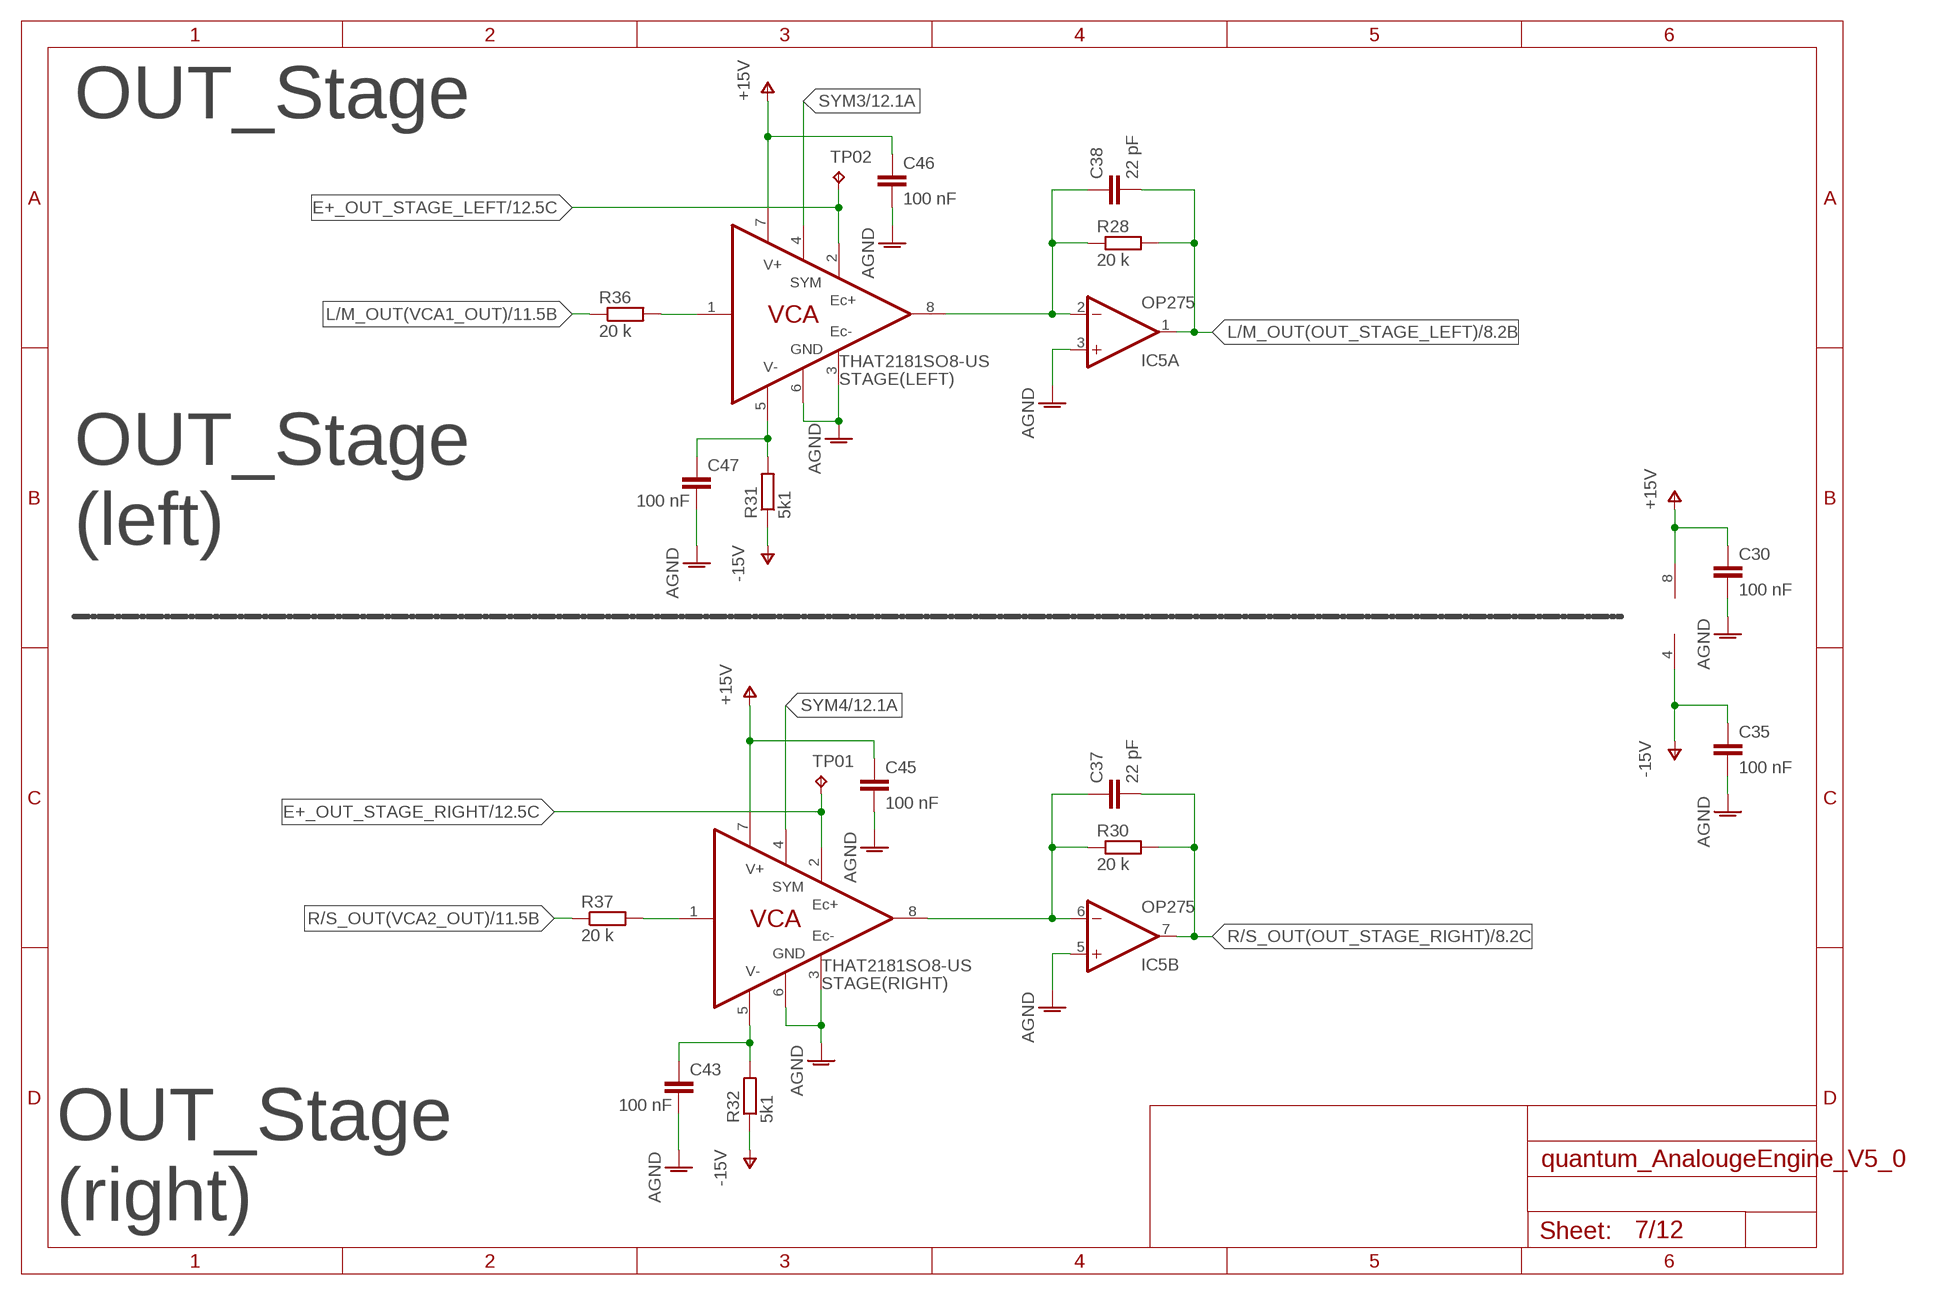
[diagram p6: schematic, sheet 7]

### Parts
C30  100 nF  CAPACITOR_0603  [C0603]
C35  100 nF  CAPACITOR_0603  [C0603]
C37  22 pF  CAPACITOR_0603  [C0603]
C38  22 pF  CAPACITOR_0603  [C0603]
C43  100 nF  CAPACITOR_0603  [C0603]
C45  100 nF  CAPACITOR_0603  [C0603]
C46  100 nF  CAPACITOR_0603  [C0603]
C47  100 nF  CAPACITOR_0603  [C0603]
IC5  OP275  [SOIC8]
R28  20 k  RESISTOR_0603  [R0603]
R30  20 k  RESISTOR_0603  [R0603]
R31  5k1  RESISTOR_0603  [R0603]
R32  5k1  RESISTOR_0603  [R0603]
R36  20 k  RESISTOR_0603  [R0603]
R37  20 k  RESISTOR_0603  [R0603]
STAGE(LEFT)  THAT2181SO8-US  [SO08]
STAGE(RIGHT)  THAT2181SO8-US  [SO08]
TP01  TPTHT  [THT_PIN]
TP02  TPTHT  [THT_PIN]

### Nets
AGND: C30.2 C35.2 C43.2 C45.2 C46.2 C47.2 IC5.3(A:+IN) IC5.5(B:+IN) STAGE(LEFT).3(EC-) STAGE(LEFT).6(GND) STAGE(RIGHT).3(EC-) STAGE(RIGHT).6(GND) ; also sheet 1,2,3,4,5,6,8,9,10,11,12
E+_OUT_STAGE_LEFT: STAGE(LEFT).2(EC+) TP02.P$1(TP) ; also sheet 12
E+_OUT_STAGE_RIGHT: STAGE(RIGHT).2(EC+) TP01.P$1(TP) ; also sheet 12
L/M_OUT(OUT_STAGE_LEFT): C38.2 IC5.1(A:OUT) R28.2 ; also sheet 8,11
L/M_OUT(VCA1_OUT): R36.1 ; also sheet 6,11
N$48: C38.1 IC5.2(A:-IN) R28.1 STAGE(LEFT).8(OUT)
N$53: C37.1 IC5.6(B:-IN) R30.1 STAGE(RIGHT).8(OUT)
N$54: C43.1 R32.2 STAGE(RIGHT).5(V-)
N$55: R36.2 STAGE(LEFT).1(IN)
N$68: R37.2 STAGE(RIGHT).1(IN)
N$73: C47.1 R31.2 STAGE(LEFT).5(V-)
R/S_OUT(OUT_STAGE_RIGHT): C37.2 IC5.7(B:OUT) R30.2 ; also sheet 8,11
R/S_OUT(VCA2_OUT): R37.1 ; also sheet 6,11
SYM3: STAGE(LEFT).4(SYM) ; also sheet 12
SYM4: STAGE(RIGHT).4(SYM) ; also sheet 12
V+: C30.1 C45.1 C46.1 IC5.8(P:V+) STAGE(LEFT).7(V+) STAGE(RIGHT).7(V+) ; supply symbol labelled +15V ; also sheet 1,2,4,5,6,8,11,12
V-: C35.1 IC5.4(P:V-) R31.1 R32.1 ; supply symbol labelled -15V ; also sheet 1,2,4,5,6,8,11,12

### Notes on the sheet
- OUT_Stage
- OUT_Stage 
  (left)
- OUT_Stage 
  (right)

## Sheet 8 of 12: MS Decode
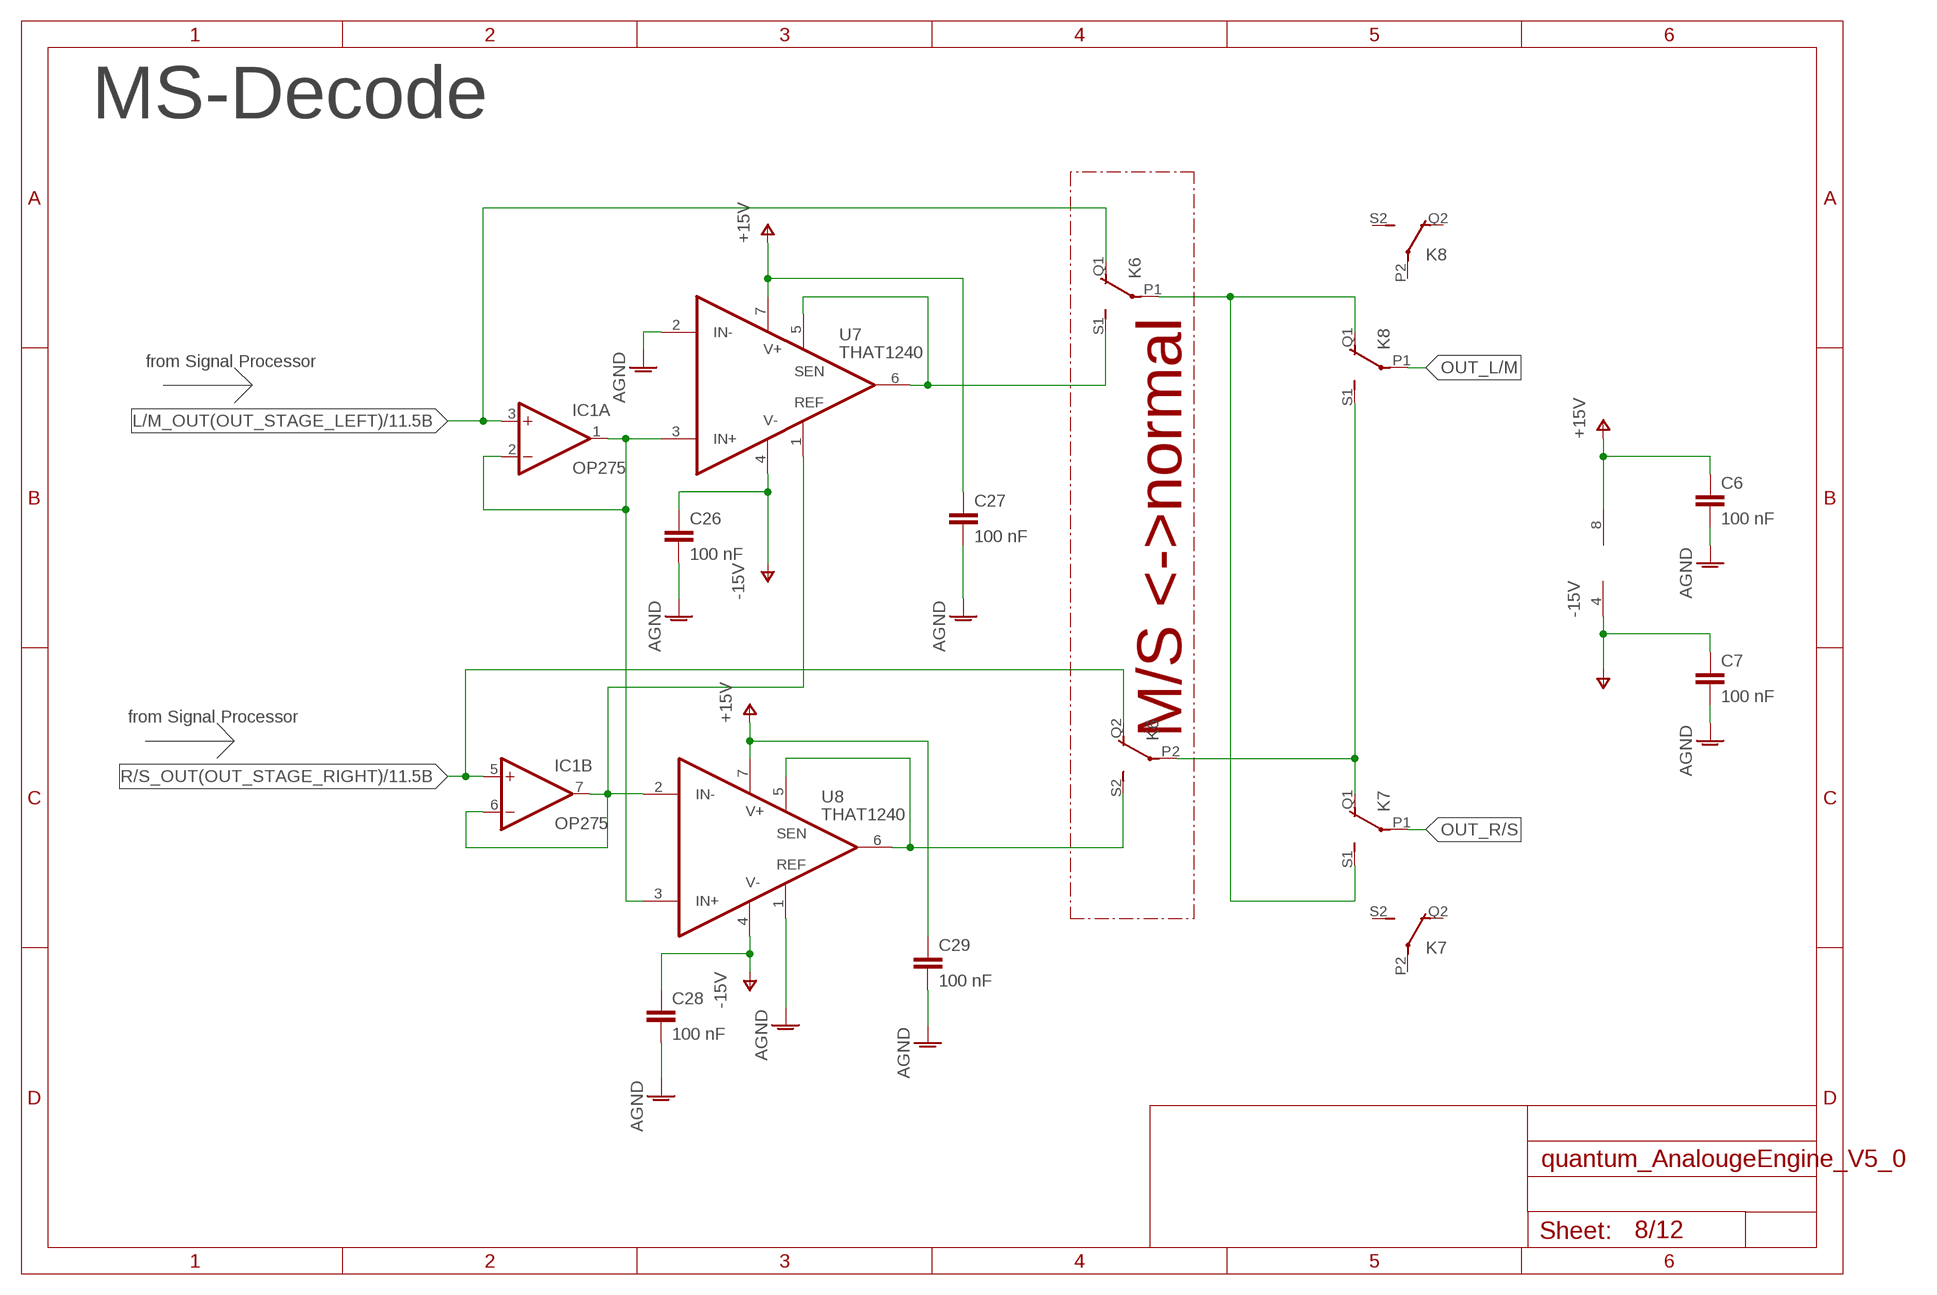
[diagram p7: schematic, sheet 8]

### Parts
C6  100 nF  CAPACITOR_0603  [C0603]
C7  100 nF  CAPACITOR_0603  [C0603]
C26  100 nF  CAPACITOR_0603  [C0603]
C27  100 nF  CAPACITOR_0603  [C0603]
C28  100 nF  CAPACITOR_0603  [C0603]
C29  100 nF  CAPACITOR_0603  [C0603]
IC1  OP275  [SOIC8]
U7  THAT1240  THAT1240SO8-USO8-U  [SO08]
U8  THAT1240  THAT1240SO8-USO8-U  [SO08]

### Nets
AGND: C6.2 C7.2 C26.2 C27.2 C28.2 C29.2 U7.2(IN-) U8.1(REF) ; also sheet 1,2,3,4,5,6,7,9,10,11,12
L/M_OUT(OUT_STAGE_LEFT): IC1.3(A:+IN) K6.Q1(2:O) ; also sheet 7,11
M1: K6.S1(2:S) U7.5(SEN) U7.6(OUT)
N$5: K6.P1(2:P) K7.S1(2:S) K8.Q1(2:O)
N$19: K6.P2(3:P) K7.Q1(2:O) K8.S1(2:S)
N$43: IC1.6(B:-IN) IC1.7(B:OUT) U7.1(REF) U8.2(IN-)
N$45: IC1.1(A:OUT) IC1.2(A:-IN) U7.3(IN+) U8.3(IN+)
OUT_L/M: K8.P1(2:P) ; also sheet 4
OUT_R/S: K7.P1(2:P) ; also sheet 2
R/S_OUT(OUT_STAGE_RIGHT): IC1.5(B:+IN) K6.Q2(3:O) ; also sheet 7,11
S1: K6.S2(3:S) U8.5(SEN) U8.6(OUT)
V+: C6.1 C27.1 C29.1 IC1.8(P:V+) U7.7(V+) U8.7(V+) ; supply symbol labelled +15V ; also sheet 1,2,4,5,6,7,11,12
V-: C7.1 C26.1 C28.1 IC1.4(P:V-) U7.4(V-) U8.4(V-) ; supply symbol labelled -15V ; also sheet 1,2,4,5,6,7,11,12
Unconnected: K7.P2(3:P) K7.Q2(3:O) K7.S2(3:S) K8.P2(3:P) K8.Q2(3:O) K8.S2(3:S)

### Notes on the sheet
- MS-Decode
- from Signal Processor
- M/S <->normal
- from Signal Processor

## Sheet 9 of 12: Main Controller
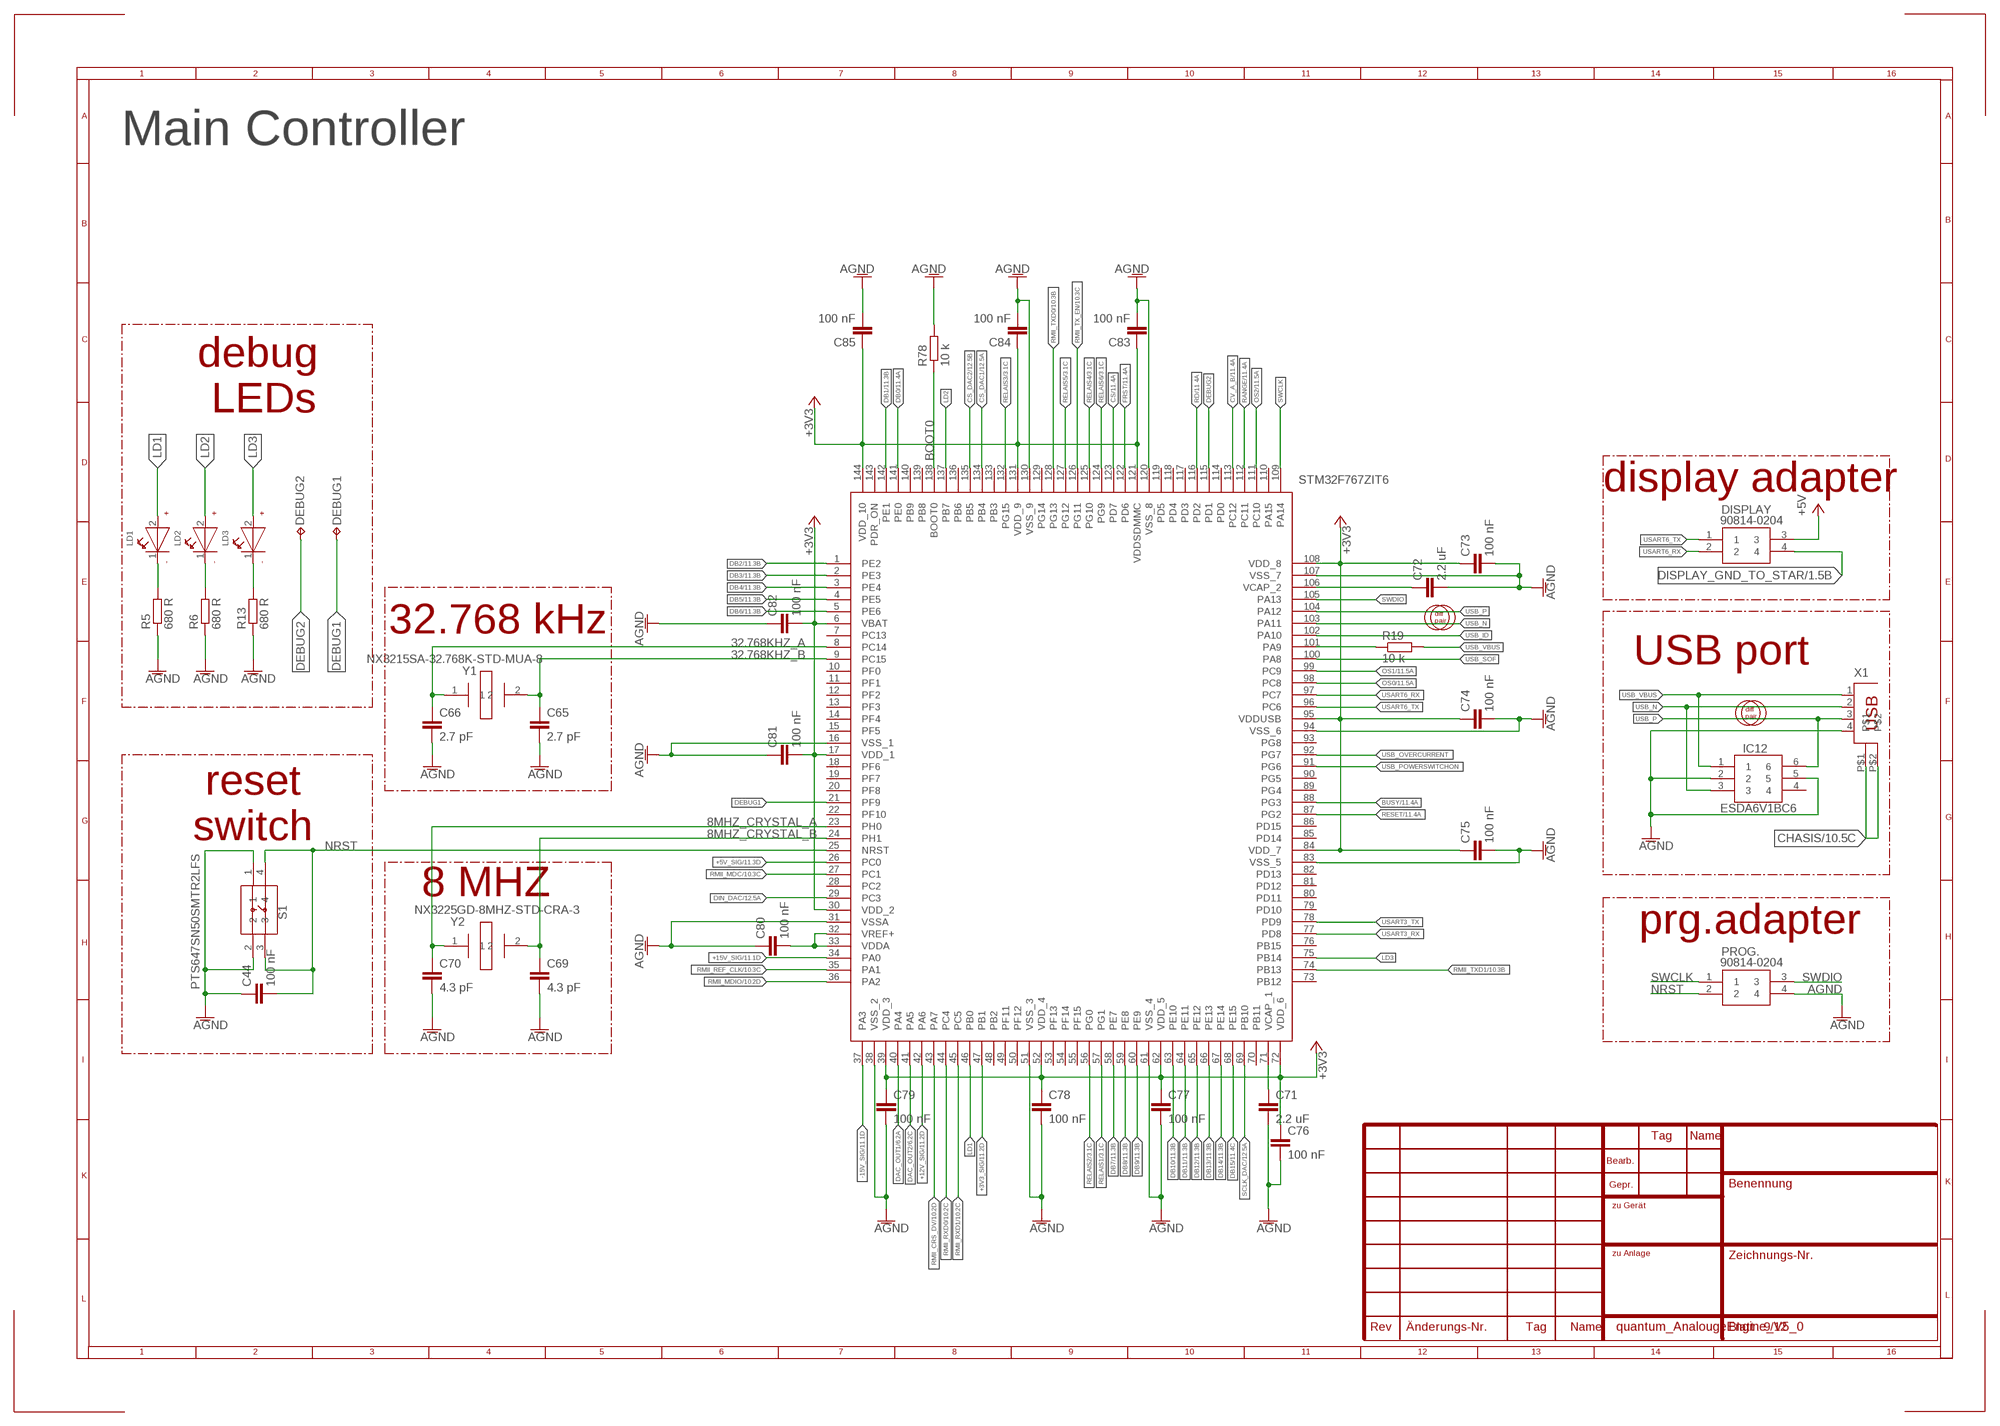
[diagram p8: schematic, sheet 9]

### Parts
C44  100 nF  CAPACITOR_0603  [C0603]
C65  2.7 pF  CAPACITOR_0603  [C0603]
C66  2.7 pF  CAPACITOR_0603  [C0603]
C69  4.3 pF  CAPACITOR_0603  [C0603]
C70  4.3 pF  CAPACITOR_0603  [C0603]
C71  2.2 uF  CAPACITOR_1206  [C1206]
C72  2.2 uF  CAPACITOR_1206  [C1206]
C73  100 nF  CAPACITOR_0603  [C0603]
C74  100 nF  CAPACITOR_0603  [C0603]
C75  100 nF  CAPACITOR_0603  [C0603]
C76  100 nF  CAPACITOR_0603  [C0603]
C77  100 nF  CAPACITOR_0603  [C0603]
C78  100 nF  CAPACITOR_0603  [C0603]
C79  100 nF  CAPACITOR_0603  [C0603]
C80  100 nF  CAPACITOR_0603  [C0603]
C81  100 nF  CAPACITOR_0603  [C0603]
C82  100 nF  CAPACITOR_0603  [C0603]
C83  100 nF  CAPACITOR_0603  [C0603]
C84  100 nF  CAPACITOR_0603  [C0603]
C85  100 nF  CAPACITOR_0603  [C0603]
DEBUG1  TPTHT  [THT_PIN]
DEBUG2  TPTHT  [THT_PIN]
DISPLAY  90814-0204  [MOLEX_90814-0204]
IC10  STM32F767ZIT6  [QFP50P2200X2200X160-144N]
IC12  ESDA6V1BC6  [SOT95P280X145-6N]
LD1  LED_YELOW_SMD  [WL-SMCW_0603]
LD2  LED_RED_SMD  [WL-SMCW_0603]
LD3  LED_GREEN_SMD  [WL-SMCW_0603]
PROG.  90814-0204  [MOLEX_90814-0204]
R5  680 R  RESISTOR_0603  [R0603]
R6  680 R  RESISTOR_0603  [R0603]
R13  680 R  RESISTOR_0603  [R0603]
R19  10 k  RESISTOR_0603  [R0603]
R78  10 k  RESISTOR_0603  [R0603]
S1  PTS647SN50SMTR2LFS  [PTS647SN50SMTR2LFS]
X1  USB_B_CONNECTOR  [SMARTPRJ_PN61729]
Y1  NX3215SA-32.768K-STD-MUA-8  [NX3215SA]
Y2  NX3225GD-8MHZ-STD-CRA-3  [RESC3226X100N]

### Nets
8MHZ_CRYSTAL_A: C70.1 IC10.23(PH0) Y2.1
8MHZ_CRYSTAL_B: C69.1 IC10.24(PH1) Y2.2
32.768KHZ_A: C66.1 IC10.8(PC14) Y1.1
32.768KHZ_B: C65.1 IC10.9(PC15) Y1.2
+3V3: C73.1 C74.1 C75.1 C76.1 C77.1 C78.1 C79.1 C81.2 C82.2 C83.1 C84.1 C85.1 IC10.6(VBAT) IC10.17(VDD_1) IC10.30(VDD_2) IC10.39(VDD_3) IC10.52(VDD_4) IC10.62(VDD_5) IC10.72(VDD_6) IC10.84(VDD_7) IC10.95(VDDUSB) IC10.108(VDD_8) IC10.121(VDDSDMMC) IC10.131(VDD_9) IC10.144(VDD_10) ; also sheet 1,10,11
+3V3_SIG: IC10.47(PB1) ; also sheet 11
+5V: DISPLAY.3 ; also sheet 1,11,12
+5V_SIG: IC10.26(PC0) ; also sheet 11
+12V_SIG: IC10.42(PA6) ; also sheet 11
+15V_SIG: IC10.34(PA0) ; also sheet 11
-15V_SIG: IC10.37(PA3) ; also sheet 11
AGND: C44.1 C65.2 C66.2 C69.2 C70.2 C71.2 C72.2 C73.2 C74.2 C75.2 C76.2 C77.2 C78.2 C79.2 C80.1 C81.1 C82.1 C83.2 C84.2 C85.2 IC10.16(VSS_1) IC10.31(VSSA) IC10.38(VSS_2) IC10.51(VSS_3) IC10.61(VSS_4) IC10.83(VSS_5) IC10.94(VSS_6) IC10.107(VSS_7) IC10.120(VSS_8) IC10.130(VSS_9) IC12.2 IC12.5 PROG..4 R5.1 R6.1 R13.1 R78.2 S1.1 S1.2 X1.4 ; also sheet 1,2,3,4,5,6,7,8,10,11,12
BOOT0: IC10.138(BOOT0) R78.1
BUSY: IC10.88(PG3) ; also sheet 11
CHASIS: X1.P$1 X1.P$2 ; also sheet 1,2,4,10
CS: IC10.123(PD7) ; also sheet 11
CS_DAC1: IC10.134(PB4) ; also sheet 12
CS_DAC2: IC10.135(PB5) ; also sheet 12
CV_A_B: IC10.113(PC12) ; also sheet 11
DAC_OUT1: IC10.40(PA4) ; also sheet 6
DAC_OUT2: IC10.41(PA5) ; also sheet 6
DB0: IC10.141(PE0) ; also sheet 11
DB1: IC10.142(PE1) ; also sheet 11
DB2: IC10.1(PE2) ; also sheet 11
DB3: IC10.2(PE3) ; also sheet 11
DB4: IC10.3(PE4) ; also sheet 11
DB5: IC10.4(PE5) ; also sheet 11
DB6: IC10.5(PE6) ; also sheet 11
DB7: IC10.58(PE7) ; also sheet 11
DB8: IC10.59(PE8) ; also sheet 11
DB9: IC10.60(PE9) ; also sheet 11
DB10: IC10.63(PE10) ; also sheet 11
DB11: IC10.64(PE11) ; also sheet 11
DB12: IC10.65(PE12) ; also sheet 11
DB13: IC10.66(PE13) ; also sheet 11
DB14: IC10.67(PE14) ; also sheet 11
DB15: IC10.68(PE15) ; also sheet 11
DEBUG1: DEBUG1.P$1(TP) IC10.21(PF9)
DEBUG2: DEBUG2.P$1(TP) IC10.115(PD1)
DIN_DAC: IC10.29(PC3) ; also sheet 12
DISPLAY_GND_TO_STAR: DISPLAY.4 ; also sheet 1
FRST: IC10.122(PD6) ; also sheet 11
LD1: IC10.46(PB0) LD1.2(+)
LD2: IC10.137(PB7) LD2.2(+)
LD3: IC10.75(PB14) LD3.2(+)
N$6: LD1.1(-) R5.2
N$10: IC10.101(PA9) R19.1
N$12: LD2.1(-) R6.2
N$15: C71.1 IC10.71(VCAP_1)
N$17: C72.1 IC10.106(VCAP_2)
N$20: C80.2 IC10.32(VREF+) IC10.33(VDDA)
N$34: LD3.1(-) R13.2
NRST: C44.2 IC10.25(NRST) PROG..2 S1.3 S1.4 ; also sheet 10
OS0: IC10.98(PC8) ; also sheet 11
OS1: IC10.99(PC9) ; also sheet 11
OS2: IC10.111(PC10) ; also sheet 11
RANGE: IC10.112(PC11) ; also sheet 11
RD: IC10.116(PD2) ; also sheet 11
RELAIS1: IC10.57(PG1) ; also sheet 3
RELAIS2: IC10.56(PG0) ; also sheet 3
RELAIS3: IC10.132(PG15) ; also sheet 3
RELAIS4: IC10.125(PG10) ; also sheet 3
RELAIS5: IC10.127(PG12) ; also sheet 3
RELAIS6: IC10.124(PG9) ; also sheet 3
RESET: IC10.87(PG2) ; also sheet 11
RMII_CRS_DV: IC10.43(PA7) ; also sheet 10
RMII_MDC: IC10.27(PC1) ; also sheet 10
RMII_MDIO: IC10.36(PA2) ; also sheet 10
RMII_REF_CLK: IC10.35(PA1) ; also sheet 10
RMII_RXD0: IC10.44(PC4) ; also sheet 10
RMII_RXD1: IC10.45(PC5) ; also sheet 10
RMII_TX_EN: IC10.126(PG11) ; also sheet 10
RMII_TXD0: IC10.128(PG13) ; also sheet 10
RMII_TXD1: IC10.74(PB13) ; also sheet 10
SCLK_DAC: IC10.69(PB10) ; also sheet 12
SWCLK: IC10.109(PA14) PROG..1
SWDIO: IC10.105(PA13) PROG..3
USART3_RX: IC10.77(PD8)
USART3_TX: IC10.78(PD9)
USART6_RX: DISPLAY.2 IC10.97(PC7)
USART6_TX: DISPLAY.1 IC10.96(PC6)
USB_ID: IC10.102(PA10)
USB_N: IC10.103(PA11) IC12.3 X1.2
USB_OVERCURRENT: IC10.92(PG7)
USB_P: IC10.104(PA12) IC12.6 X1.3
USB_POWERSWITCHON: IC10.91(PG6)
USB_SOF: IC10.100(PA8)
USB_VBUS: IC12.1 R19.2 X1.1
Unconnected: IC10.7(PC13) IC10.10(PF0) IC10.11(PF1) IC10.12(PF2) IC10.13(PF3) IC10.14(PF4) IC10.15(PF5) IC10.18(PF6) IC10.19(PF7) IC10.20(PF8) IC10.22(PF10) IC10.28(PC2) IC10.48(PB2) IC10.49(PF11) IC10.50(PF12) IC10.53(PF13) IC10.54(PF14) IC10.55(PF15) IC10.70(PB11) IC10.73(PB12) IC10.76(PB15) IC10.79(PD10) IC10.80(PD11) IC10.81(PD12) IC10.82(PD13) IC10.85(PD14) IC10.86(PD15) IC10.89(PG4) IC10.90(PG5) IC10.93(PG8) IC10.110(PA15) IC10.114(PD0) IC10.117(PD3) IC10.118(PD4) IC10.119(PD5) IC10.129(PG14) IC10.133(PB3) IC10.136(PB6) IC10.139(PB8) IC10.140(PB9) IC10.143(PDR_ON) IC12.4

### Notes on the sheet
- Main Controller
- debug 
  LEDs
- display adapter
- 32.768 kHz
- diff
  pair
- USB port
- diff
  pair
- reset
  switch
- 8 MHZ
- prg.adapter

## Sheet 10 of 12: Ethernet PHY
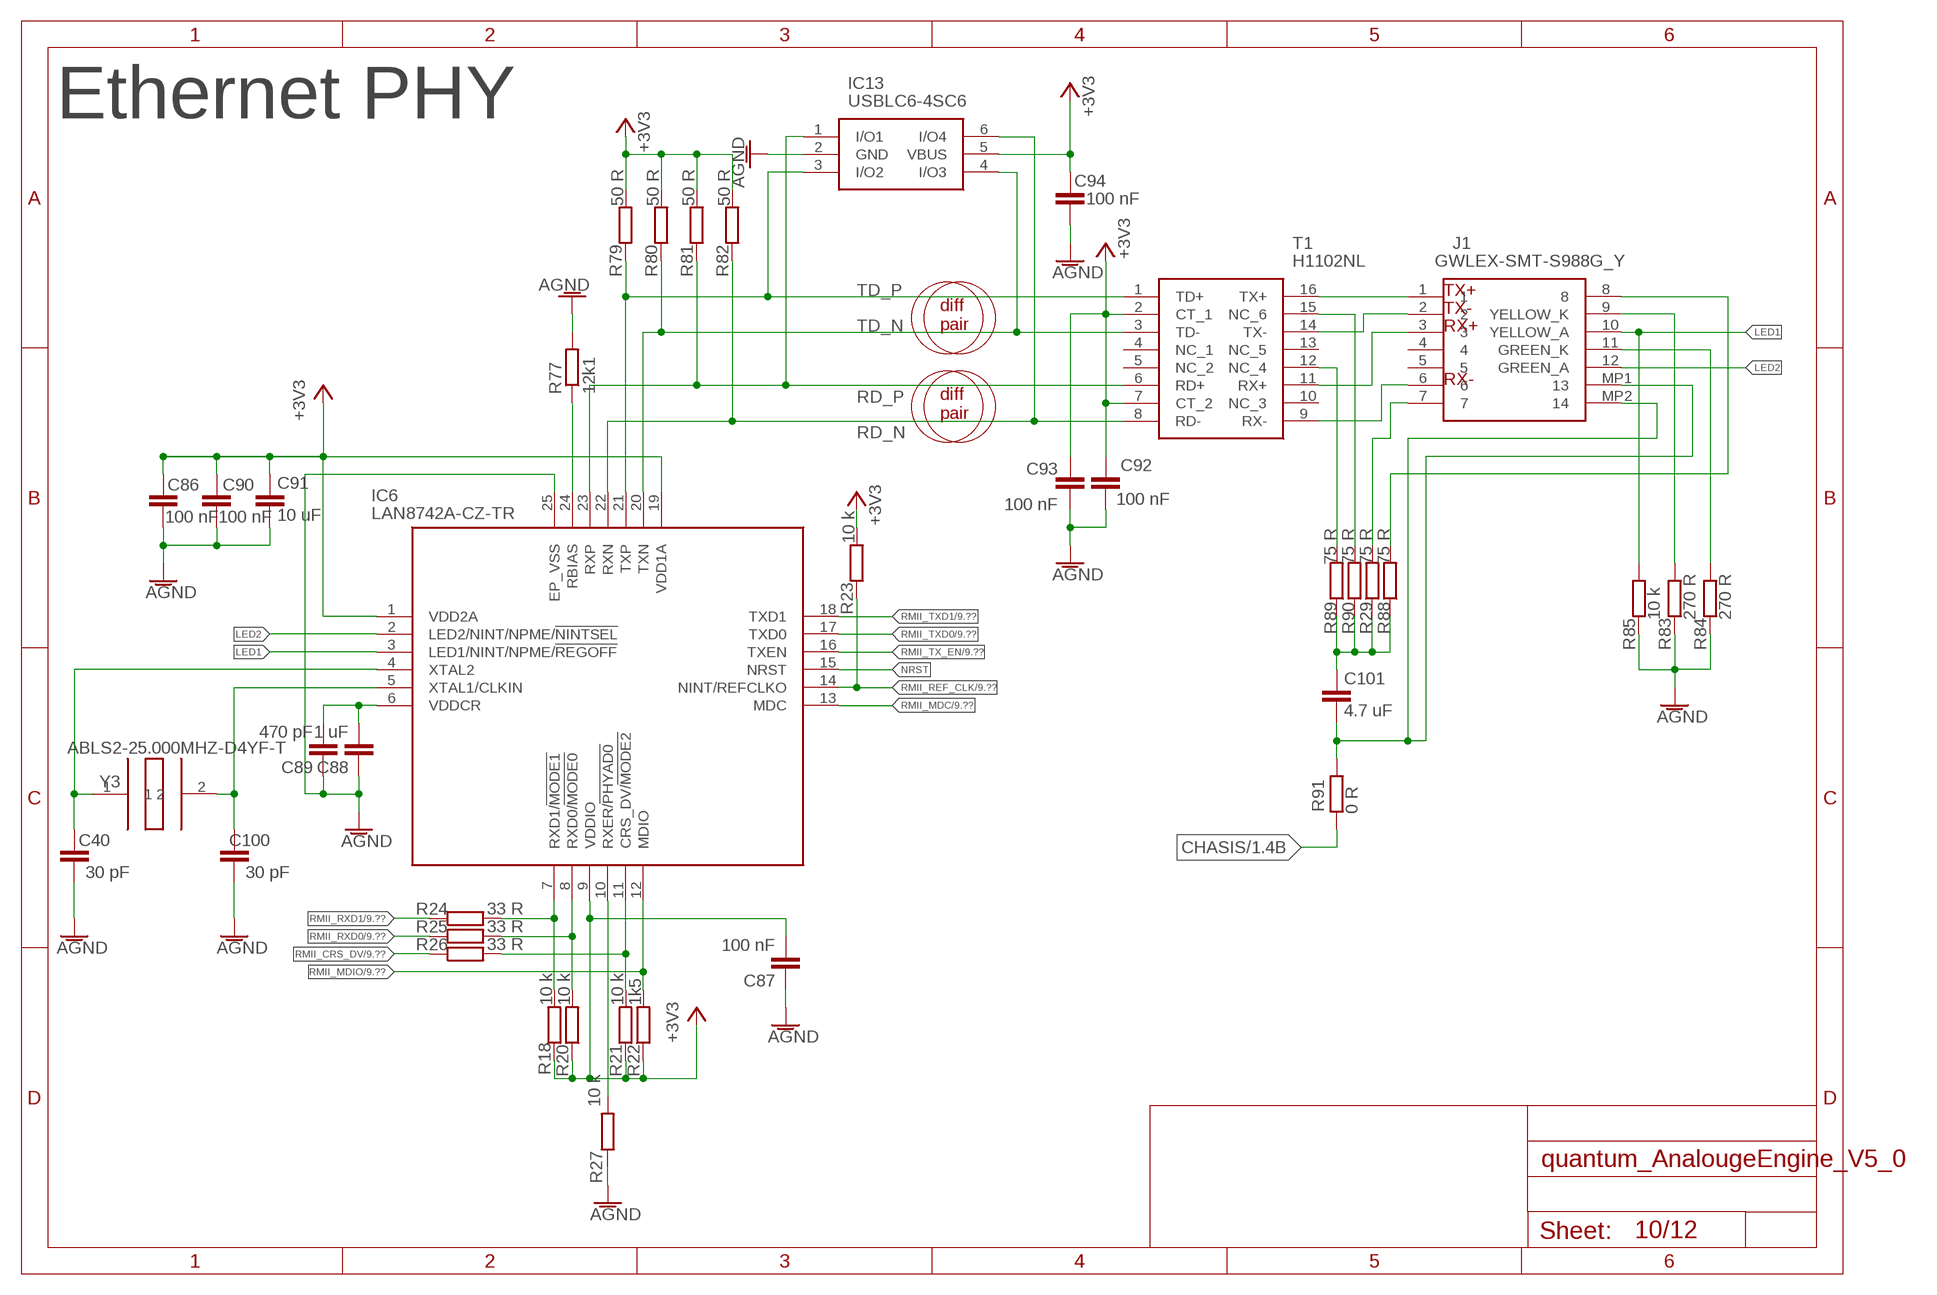
[diagram p9: schematic, sheet 10]

### Parts
C40  30 pF  CAPACITOR_0603  [C0603]
C86  100 nF  CAPACITOR_0603  [C0603]
C87  100 nF  CAPACITOR_0603  [C0603]
C88  1 uF  CAPACITOR_0603  [C0603]
C89  470 pF  CAPACITOR_0603  [C0603]
C90  100 nF  CAPACITOR_0603  [C0603]
C91  10 uF  CAPACITOR_1206  [C1206]
C92  100 nF  CAPACITOR_0603  [C0603]
C93  100 nF  CAPACITOR_0603  [C0603]
C94  100 nF  CAPACITOR_0603  [C0603]
C100  30 pF  CAPACITOR_0603  [C0603]
C101  4.7 uF  CAPACITOR_1206  [C1206]
IC6  LAN8742A-CZ-TR  [QFN50P400X400X100-25N]
IC13  USBLC6-4SC6  [SOT95P280X145-6N]
J1  GWLEX-SMT-S988G_Y  [GWLEXSMTS988GY]
R18  10 k  RESISTOR_0603  [R0603]
R20  10 k  RESISTOR_0603  [R0603]
R21  10 k  RESISTOR_0603  [R0603]
R22  1k5  RESISTOR_0603  [R0603]
R23  10 k  RESISTOR_0603  [R0603]
R24  33 R  RESISTOR_0603  [R0603]
R25  33 R  RESISTOR_0603  [R0603]
R26  33 R  RESISTOR_0603  [R0603]
R27  10 k  RESISTOR_0603  [R0603]
R29  75 R  RESISTOR_0603  [R0603]
R77  12k1  RESISTOR_0603  [R0603]
R79  50 R  RESISTOR_0603  [R0603]
R80  50 R  RESISTOR_0603  [R0603]
R81  50 R  RESISTOR_0603  [R0603]
R82  50 R  RESISTOR_0603  [R0603]
R83  270 R  RESISTOR_0603  [R0603]
R84  270 R  RESISTOR_0603  [R0603]
R85  10 k  RESISTOR_0603  [R0603]
R88  75 R  RESISTOR_0603  [R0603]
R89  75 R  RESISTOR_0603  [R0603]
R90  75 R  RESISTOR_0603  [R0603]
R91  0 R  RESISTOR_0603  [R0603]
T1  H1102NL  [SOIC127P940X597-16N]
Y3  ABLS2-25.000MHZ-D4YF-T  [ABLS]

### Nets
+3V3: C86.2 C87.2 C90.2 C91.1 C92.2 C93.2 C94.2 IC6.1(VDD2A) IC6.9(VDDIO) IC6.19(VDD1A) IC13.5(VBUS) R18.1 R20.1 R21.1 R22.1 R23.2 R79.2 R80.2 R81.2 R82.2 T1.2(CT_1) T1.7(CT_2) ; also sheet 1,9,11
AGND: C40.1 C86.1 C87.1 C88.1 C89.1 C90.1 C91.2 C92.1 C93.1 C94.1 C100.1 IC6.25(EP_VSS) IC13.2(GND) R27.1 R77.2 R83.1 R84.1 R85.1 ; also sheet 1,2,3,4,5,6,7,8,9,11,12
CHASIS: R91.1 ; also sheet 1,2,4,9
LED1: IC6.3(LED1/NINT/NPME/!REGOFF) J1.10(YELLOW_A) R85.2
LED2: IC6.2(LED2/NINT/NPME/!NINTSEL) J1.12(GREEN_A)
N$21: IC6.7(RXD1/!MODE1) R18.2 R24.2
N$22: IC6.8(RXD0/!MODE0) R20.2 R25.2
N$23: IC6.11(CRS_DV/!MODE2) R21.2 R26.2
N$24: IC6.10(RXER/!PHYAD0) R27.2
N$25: IC6.24(RBIAS) R77.1
N$27: C88.2 C89.2 IC6.6(VDDCR)
N$35: J1.1 T1.16(TX+)
N$36: J1.2 T1.14(TX-)
N$37: J1.3 T1.11(RX+)
N$46: J1.6 T1.9(RX-)
N$50: J1.11(GREEN_K) R84.2
N$52: J1.9(YELLOW_K) R83.2
N$69: C40.2 IC6.4(XTAL2) Y3.1
N$70: C100.2 IC6.5(XTAL1/CLKIN) Y3.2
N$86: J1.7 R29.2
N$87: J1.8 R88.2
N$88: R89.2 T1.12(NC_4)
N$89: R90.2 T1.15(NC_6)
N$90: C101.1 R29.1 R88.1 R89.1 R90.1
N$92: C101.2 J1.MP1 J1.MP2 R91.2
NRST: IC6.15(NRST) ; also sheet 9
RD_N: IC6.22(RXN) IC13.6(I/O4) R82.1 T1.8(RD-)
RD_P: IC6.23(RXP) IC13.1(I/O1) R81.1 T1.6(RD+)
RMII_CRS_DV: R26.1 ; also sheet 9
RMII_MDC: IC6.13(MDC) ; also sheet 9
RMII_MDIO: IC6.12(MDIO) R22.2 ; also sheet 9
RMII_REF_CLK: IC6.14(NINT/REFCLKO) R23.1 ; also sheet 9
RMII_RXD0: R25.1 ; also sheet 9
RMII_RXD1: R24.1 ; also sheet 9
RMII_TX_EN: IC6.16(TXEN) ; also sheet 9
RMII_TXD0: IC6.17(TXD0) ; also sheet 9
RMII_TXD1: IC6.18(TXD1) ; also sheet 9
TD_N: IC6.20(TXN) IC13.4(I/O3) R80.1 T1.3(TD-)
TD_P: IC6.21(TXP) IC13.3(I/O2) R79.1 T1.1(TD+)
Unconnected: J1.4 J1.5 T1.4(NC_1) T1.5(NC_2) T1.10(NC_3) T1.13(NC_5)

### Notes on the sheet
- Ethernet PHY
- diff
  pair
- diff
  pair

## Sheet 11 of 12: AD Converter
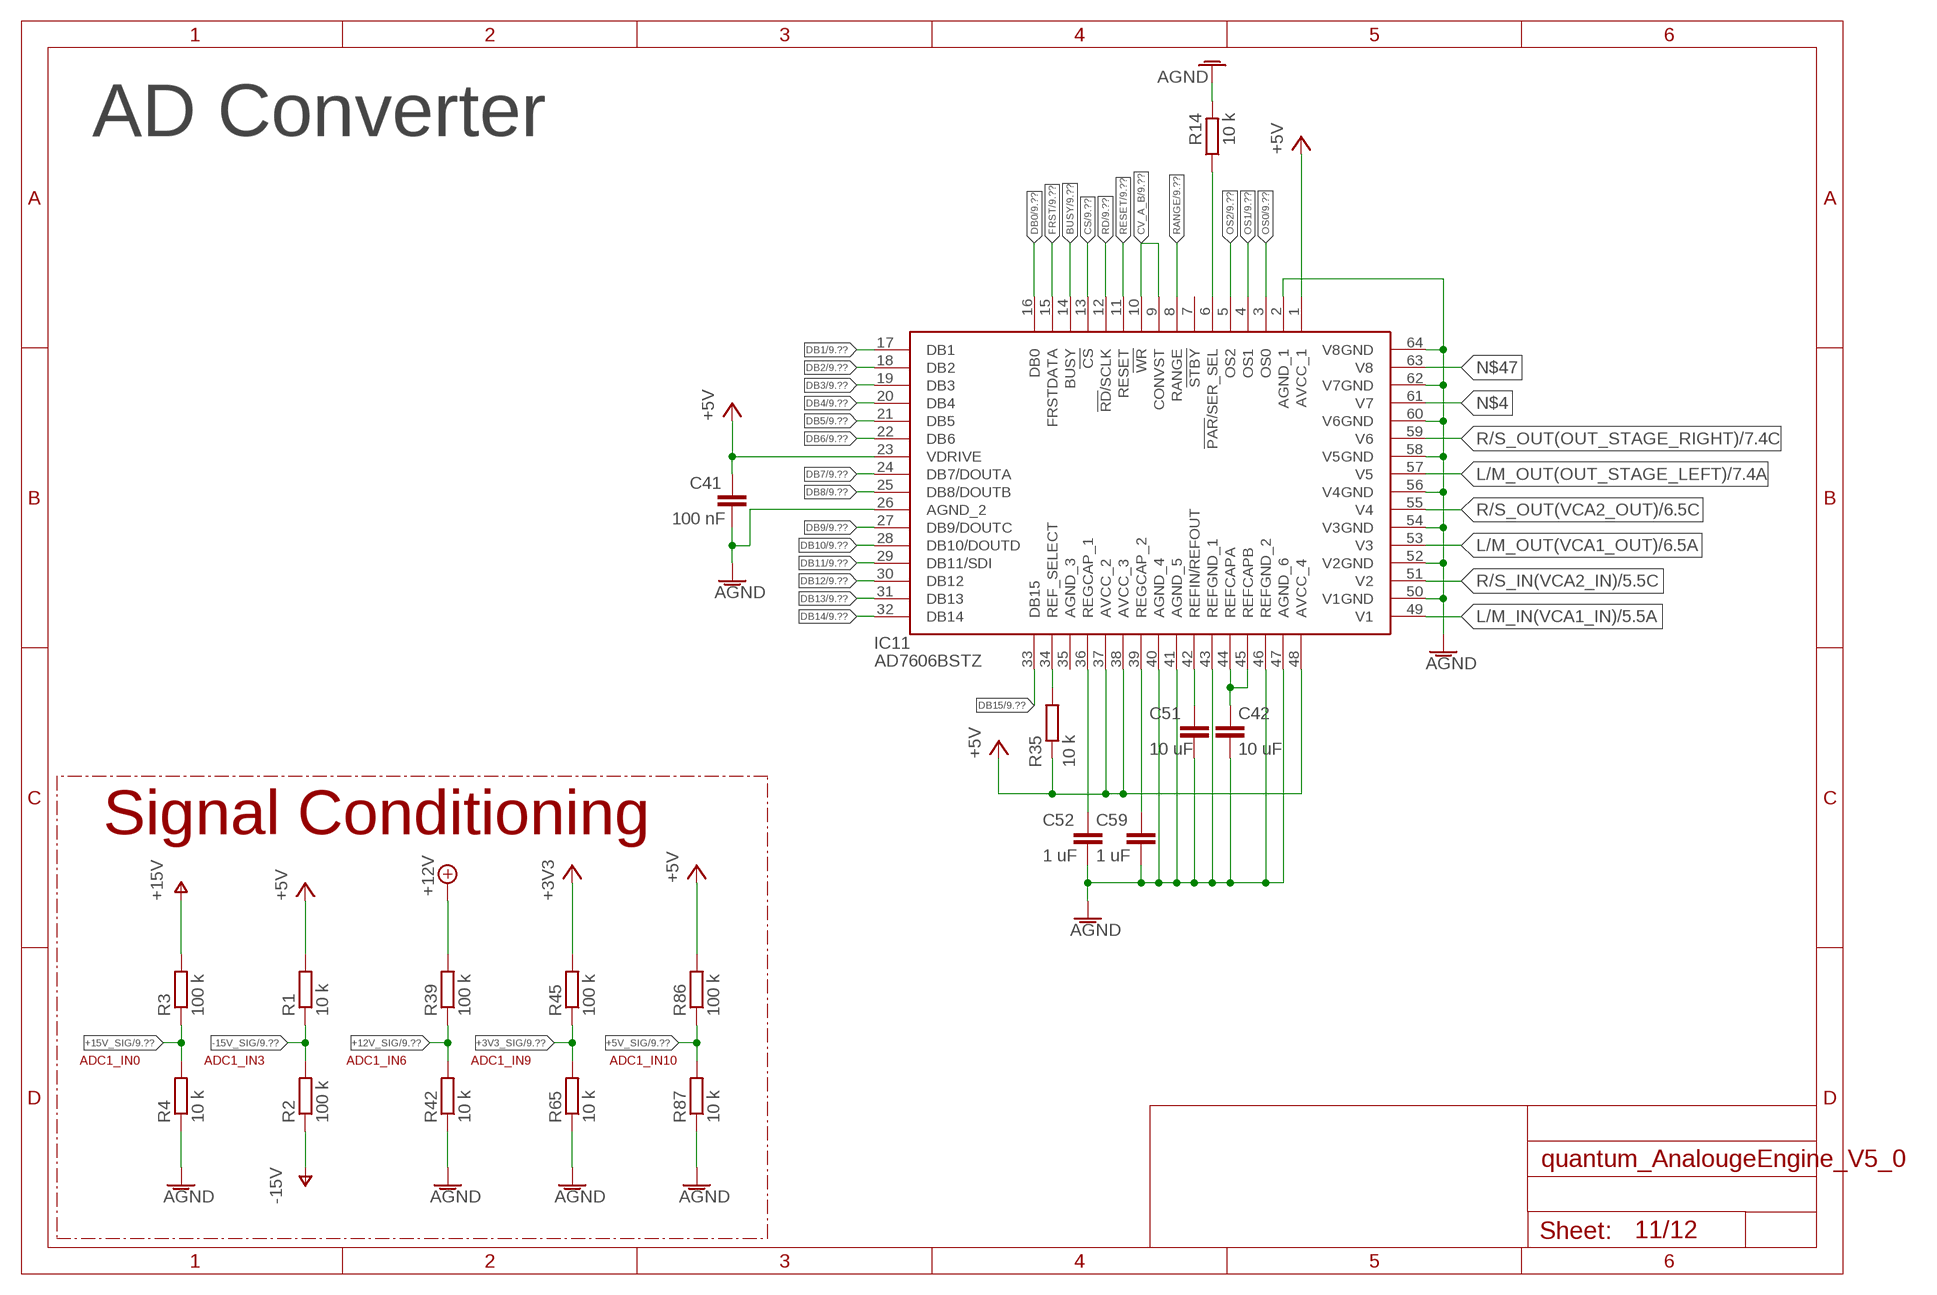
[diagram p10: schematic, sheet 11]

### Parts
C41  100 nF  CAPACITOR_0603  [C0603]
C42  10 uF  CAPACITOR_1206  [C1206]
C51  10 uF  CAPACITOR_1206  [C1206]
C52  1 uF  CAPACITOR_0603  [C0603]
C59  1 uF  CAPACITOR_0603  [C0603]
IC11  AD7606BSTZ  [QFP50P1200X1200X160-64N]
R1  10 k  RESISTOR_0603  [R0603]
R2  100 k  RESISTOR_0603  [R0603]
R3  100 k  RESISTOR_0603  [R0603]
R4  10 k  RESISTOR_0603  [R0603]
R14  10 k  RESISTOR_0603  [R0603]
R35  10 k  RESISTOR_0603  [R0603]
R39  100 k  RESISTOR_0603  [R0603]
R42  10 k  RESISTOR_0603  [R0603]
R45  100 k  RESISTOR_0603  [R0603]
R65  10 k  RESISTOR_0603  [R0603]
R86  100 k  RESISTOR_0603  [R0603]
R87  10 k  RESISTOR_0603  [R0603]

### Nets
+3V3: R45.2 ; also sheet 1,9,10
+3V3_SIG: R45.1 R65.2 ; also sheet 9
+5V: C41.1 IC11.1(AVCC_1) IC11.23(VDRIVE) IC11.37(AVCC_2) IC11.38(AVCC_3) IC11.48(AVCC_4) R1.2 R35.1 R86.2 ; also sheet 1,9,12
+5V_SIG: R86.1 R87.2 ; also sheet 9
+12V: R39.2 ; also sheet 1,3
+12V_SIG: R39.1 R42.2 ; also sheet 9
+15V_SIG: R3.1 R4.2 ; also sheet 9
-15V_SIG: R1.1 R2.2 ; also sheet 9
AGND: C41.2 C42.2 C51.2 C52.2 C59.2 IC11.2(AGND_1) IC11.26(AGND_2) IC11.40(AGND_4) IC11.41(AGND_5) IC11.43(REFGND_1) IC11.46(REFGND_2) IC11.47(AGND_6) IC11.50(V1GND) IC11.52(V2GND) IC11.54(V3GND) IC11.56(V4GND) IC11.58(V5GND) IC11.60(V6GND) IC11.62(V7GND) IC11.64(V8GND) R4.1 R14.2 R42.1 R65.1 R87.1 ; also sheet 1,2,3,4,5,6,7,8,9,10,12
BUSY: IC11.14(BUSY) ; also sheet 9
CS: IC11.13(!CS) ; also sheet 9
CV_A_B: IC11.9(CONVST) IC11.10(!WR) ; also sheet 9
DB0: IC11.16(DB0) ; also sheet 9
DB1: IC11.17(DB1) ; also sheet 9
DB2: IC11.18(DB2) ; also sheet 9
DB3: IC11.19(DB3) ; also sheet 9
DB4: IC11.20(DB4) ; also sheet 9
DB5: IC11.21(DB5) ; also sheet 9
DB6: IC11.22(DB6) ; also sheet 9
DB7: IC11.24(DB7/DOUTA) ; also sheet 9
DB8: IC11.25(DB8/DOUTB) ; also sheet 9
DB9: IC11.27(DB9/DOUTC) ; also sheet 9
DB10: IC11.28(DB10/DOUTD) ; also sheet 9
DB11: IC11.29(DB11/SDI) ; also sheet 9
DB12: IC11.30(DB12) ; also sheet 9
DB13: IC11.31(DB13) ; also sheet 9
DB14: IC11.32(DB14) ; also sheet 9
DB15: IC11.33(DB15) ; also sheet 9
FRST: IC11.15(FRSTDATA) ; also sheet 9
L/M_IN(VCA1_IN): IC11.49(V1) ; also sheet 5,6
L/M_OUT(OUT_STAGE_LEFT): IC11.57(V5) ; also sheet 7,8
L/M_OUT(VCA1_OUT): IC11.53(V3) ; also sheet 6,7
N$4: IC11.61(V7)
N$38: IC11.6(!PAR!/SER_SEL) R14.1
N$39: IC11.34(REF_SELECT) R35.2
N$40: C42.1 IC11.44(REFCAPA) IC11.45(REFCAPB)
N$41: C51.1 IC11.42(REFIN/REFOUT)
N$42: C52.1 IC11.36(REGCAP_1)
N$44: C59.1 IC11.39(REGCAP_2)
N$47: IC11.63(V8)
OS0: IC11.3(OS0) ; also sheet 9
OS1: IC11.4(OS1) ; also sheet 9
OS2: IC11.5(OS2) ; also sheet 9
R/S_IN(VCA2_IN): IC11.51(V2) ; also sheet 5,6
R/S_OUT(OUT_STAGE_RIGHT): IC11.59(V6) ; also sheet 7,8
R/S_OUT(VCA2_OUT): IC11.55(V4) ; also sheet 6,7
RANGE: IC11.8(RANGE) ; also sheet 9
RD: IC11.12(!RD!/SCLK) ; also sheet 9
RESET: IC11.11(RESET) ; also sheet 9
V+: R3.2 ; supply symbol labelled +15V ; also sheet 1,2,4,5,6,7,8,12
V-: R2.1 ; supply symbol labelled -15V ; also sheet 1,2,4,5,6,7,8,12
Unconnected: IC11.7(!STBY) IC11.35(AGND_3)

### Notes on the sheet
- AD Converter
- Signal Conditioning
- ADC1_IN0 | ADC1_IN3 | ADC1_IN6 | ADC1_IN9 | ADC1_IN10

## Sheet 12 of 12: DA Converter
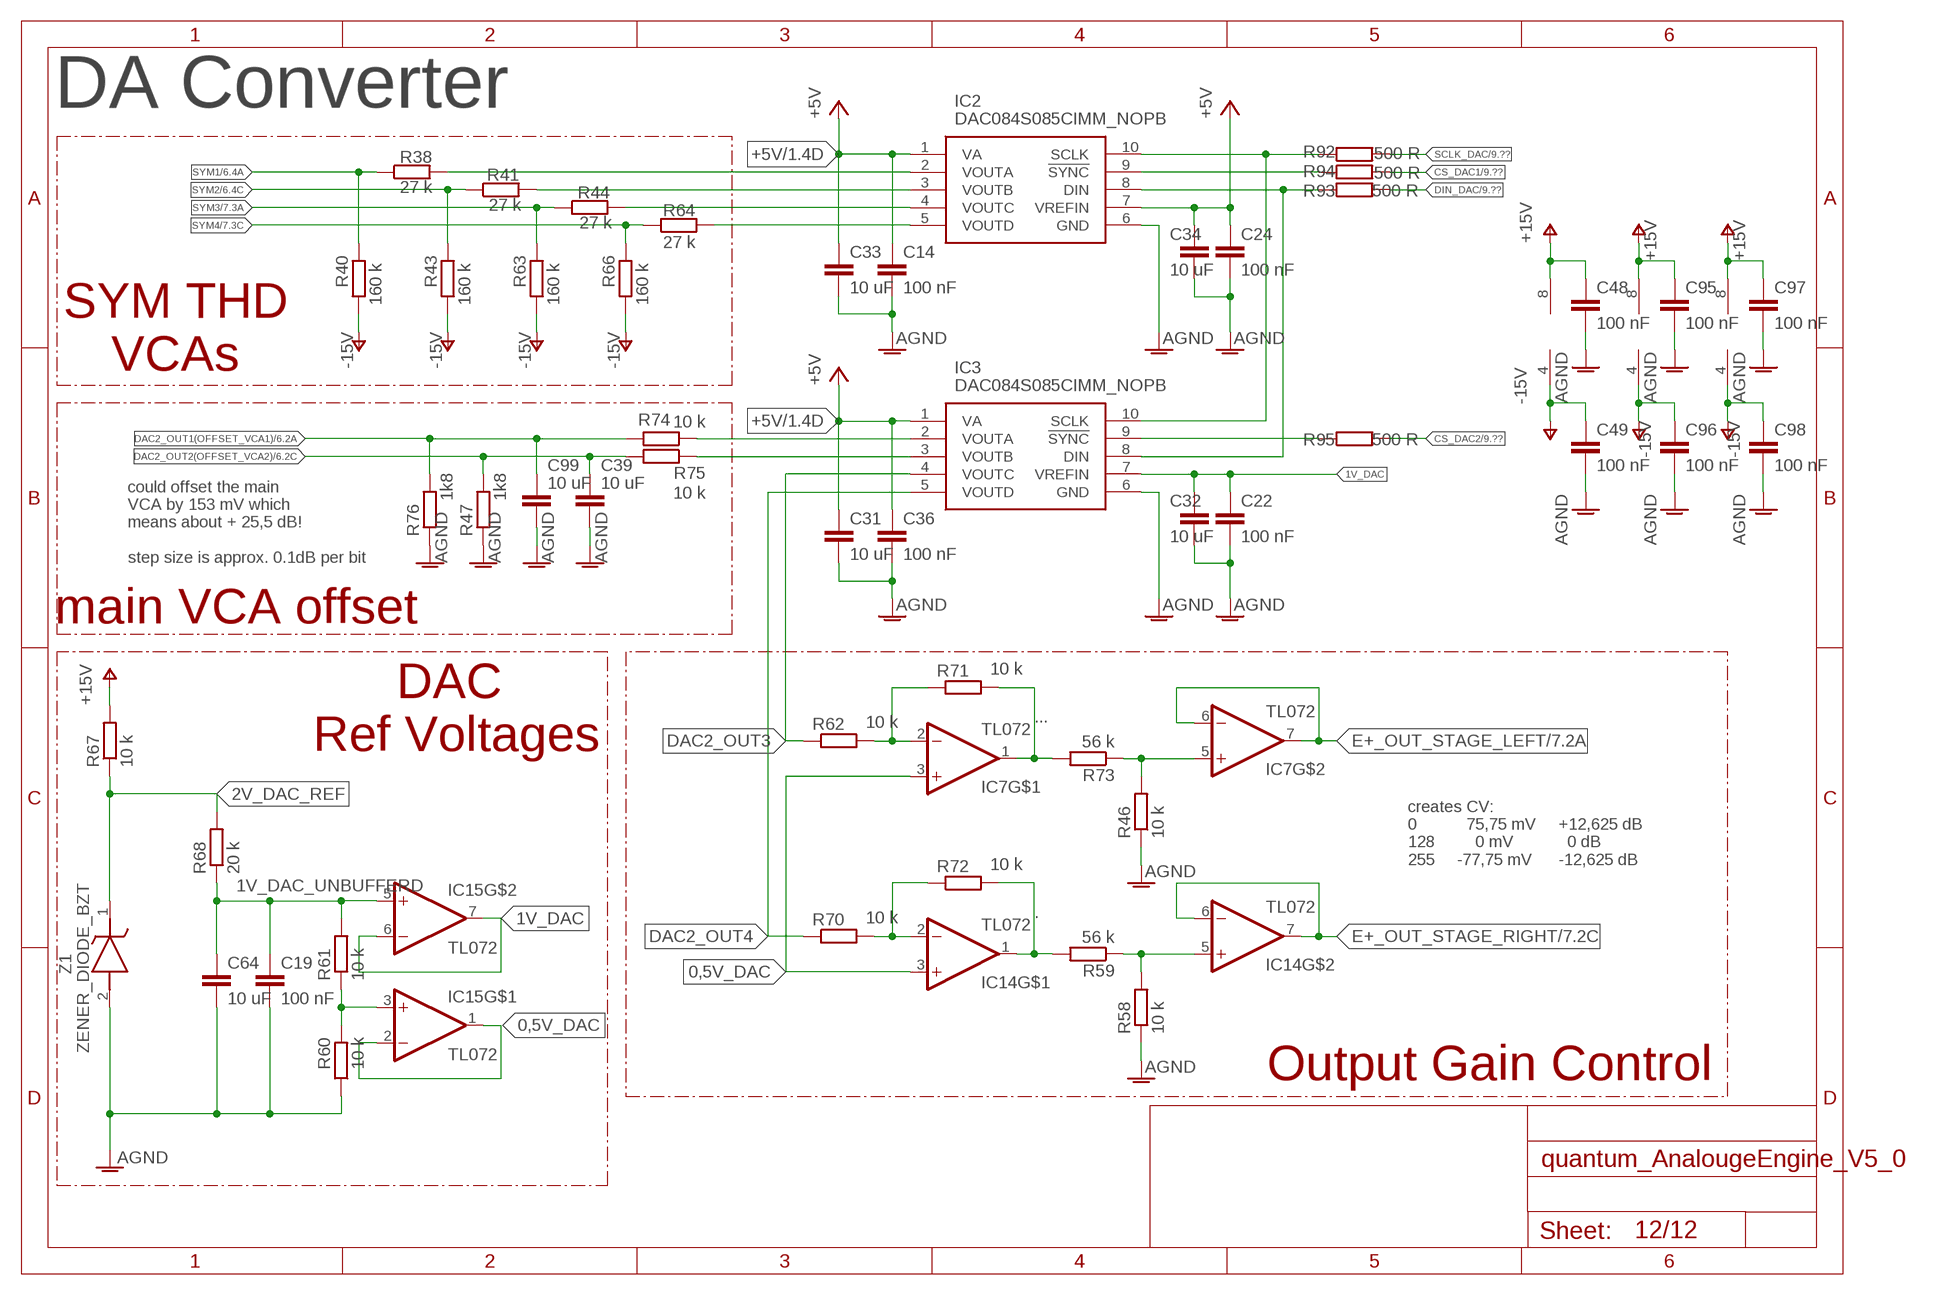
[diagram p11: schematic, sheet 12]

### Parts
C14  100 nF  CAPACITOR_0603  [C0603]
C19  100 nF  CAPACITOR_0603  [C0603]
C22  100 nF  CAPACITOR_0603  [C0603]
C24  100 nF  CAPACITOR_0603  [C0603]
C31  10 uF  CAPACITOR_1206  [C1206]
C32  10 uF  CAPACITOR_1206  [C1206]
C33  10 uF  CAPACITOR_1206  [C1206]
C34  10 uF  CAPACITOR_1206  [C1206]
C36  100 nF  CAPACITOR_0603  [C0603]
C39  10 uF  CAPACITOR_1206  [C1206]
C48  100 nF  CAPACITOR_0603  [C0603]
C49  100 nF  CAPACITOR_0603  [C0603]
C64  10 uF  CAPACITOR_1206  [C1206]
C95  100 nF  CAPACITOR_0603  [C0603]
C96  100 nF  CAPACITOR_0603  [C0603]
C97  100 nF  CAPACITOR_0603  [C0603]
C98  100 nF  CAPACITOR_0603  [C0603]
C99  10 uF  CAPACITOR_1206  [C1206]
IC2  DAC084S085CIMM_NOPB  [SOP50P490X110-10N]
IC3  DAC084S085CIMM_NOPB  [SOP50P490X110-10N]
IC7  TL072  [SOIC8]
IC14  TL072  [SOIC8]
IC15  TL072  [SOIC8]
R38  27 k  RESISTOR_0603  [R0603]
R40  160 k  RESISTOR_0603  [R0603]
R41  27 k  RESISTOR_0603  [R0603]
R43  160 k  RESISTOR_0603  [R0603]
R44  27 k  RESISTOR_0603  [R0603]
R46  10 k  RESISTOR_0603  [R0603]
R47  1k8  RESISTOR_0603  [R0603]
R58  10 k  RESISTOR_0603  [R0603]
R59  56 k  RESISTOR_0603  [R0603]
R60  10 k  RESISTOR_0603  [R0603]
R61  10 k  RESISTOR_0603  [R0603]
R62  10 k  RESISTOR_0603  [R0603]
R63  160 k  RESISTOR_0603  [R0603]
R64  27 k  RESISTOR_0603  [R0603]
R66  160 k  RESISTOR_0603  [R0603]
R67  10 k  RESISTOR_0603  [R0603]
R68  20 k  RESISTOR_0603  [R0603]
R70  10 k  RESISTOR_0603  [R0603]
R71  10 k  RESISTOR_0603  [R0603]
R72  10 k  RESISTOR_0603  [R0603]
R73  56 k  RESISTOR_0603  [R0603]
R74  10 k  RESISTOR_0603  [R0603]
R75  10 k  RESISTOR_0603  [R0603]
R76  1k8  RESISTOR_0603  [R0603]
R92  500 R  RESISTOR_0603  [R0603]
R93  500 R  RESISTOR_0603  [R0603]
R94  500 R  RESISTOR_0603  [R0603]
R95  500 R  RESISTOR_0603  [R0603]
Z1  ZENER_DIODE_BZT  [SODFL1608X65N]

### Nets
0,5V_DAC: IC7.3(+IN) IC14.3(+IN) IC15.1(OUT) IC15.2(-IN)
1V_DAC: C22.1 C32.1 IC3.7(VREFIN) IC15.6(-IN) IC15.7(OUT)
1V_DAC_UNBUFFERD: C19.1 C64.1 IC15.5(+IN) R61.2 R68.1
2V_DAC_REF: R67.1 R68.2 Z1.1(K)
+5V: C14.1 C24.1 C31.1 C33.1 C34.1 C36.1 IC2.1(VA) IC2.7(VREFIN) IC3.1(VA) ; also sheet 1,9,11
.: IC14.1(OUT) R59.2 R72.2
...: IC7.1(OUT) R71.2 R73.2
AGND: C14.2 C19.2 C22.2 C24.2 C31.2 C32.2 C33.2 C34.2 C36.2 C39.2 C48.2 C49.2 C64.2 C95.2 C96.2 C97.2 C98.2 C99.2 IC2.6(GND) IC3.6(GND) R46.1 R47.1 R58.1 R60.1 R76.1 Z1.2(A) ; also sheet 1,2,3,4,5,6,7,8,9,10,11
CS_DAC1: R94.2 ; also sheet 9
CS_DAC2: R95.2 ; also sheet 9
DAC2_OUT1(OFFSET_VCA1): C99.1 R74.2 R76.2 ; also sheet 6
DAC2_OUT2(OFFSET_VCA2): C39.1 R47.2 R75.2 ; also sheet 6
DAC2_OUT3: IC3.4(VOUTC) R62.1
DAC2_OUT4: IC3.5(VOUTD) R70.1
DIN_DAC: R93.2 ; also sheet 9
E+_OUT_STAGE_LEFT: IC7.6(-IN) IC7.7(OUT) ; also sheet 7
E+_OUT_STAGE_RIGHT: IC14.6(-IN) IC14.7(OUT) ; also sheet 7
N$56: IC2.2(VOUTA) R38.2
N$57: IC2.3(VOUTB) R41.2
N$58: IC2.4(VOUTC) R44.2
N$59: IC2.5(VOUTD) R64.2
N$60: IC3.2(VOUTA) R74.1
N$61: IC3.3(VOUTB) R75.1
N$62: IC7.5(+IN) R46.2 R73.1
N$66: IC14.5(+IN) R58.2 R59.1
N$67: IC15.3(+IN) R60.2 R61.1
N$72: IC7.2(-IN) R62.2 R71.1
N$74: IC14.2(-IN) R70.2 R72.1
N$91: IC2.10(SCLK) IC3.10(SCLK) R92.1
N$93: IC2.8(DIN) IC3.8(DIN) R93.1
N$94: IC2.9(!SYNC) R94.1
N$95: IC3.9(!SYNC) R95.1
SCLK_DAC: R92.2 ; also sheet 9
SYM1: R38.1 R40.2 ; also sheet 6
SYM2: R41.1 R43.2 ; also sheet 6
SYM3: R44.1 R63.2 ; also sheet 7
SYM4: R64.1 R66.2 ; also sheet 7
V+: C48.1 C95.1 C97.1 IC7.8(V+) IC14.8(V+) IC15.8(V+) R67.2 ; supply symbol labelled +15V ; also sheet 1,2,4,5,6,7,8,11
V-: C49.1 C96.1 C98.1 IC7.4(V-) IC14.4(V-) IC15.4(V-) R40.1 R43.1 R63.1 R66.1 ; supply symbol labelled -15V ; also sheet 1,2,4,5,6,7,8,11

### Notes on the sheet
- DA Converter
- SYM THD
  VCAs
- could offset the main 
  VCA by 153 mV which
  means about + 25,5 dB! 
  
  step size is approx. 0.1dB per bit
- main VCA offset
- DAC 
  Ref Voltages
- creates CV:
  0           75,75 mV     +12,625 dB
  128         0 mV            0 dB
  255     -77,75 mV      -12,625 dB
- Output Gain Control

## Library data of the parts
+3V3_OK +5V_OK +12V_OK +15V_OK -15V_OK LD1-LD3 LED1-LED8 = passive components:LED: LED; MOUSER_PART_NUMBER: ...
ANALOG_VOLT DIGITAL_VOLT DISPLAY PROG. = electro_mechanical:90814-0204: CONN HEADER 4POS 1.27MM SMD TIN Source: Datasheet <https://componentsearchengine.com/Datasheets/1/90814-0204.pdf>; DESCRIPTION: CONN HEADER 4POS 1.27MM SMD TIN; HEIGHT: mm; MANUFACTURER_NAME: Molex; MANUFACTURER_PART_NUMBER: 90814-0204; MOUSER_PART_NUMBER: 538-90814-0204; MOUSER_PRICE-STOCK: https://www.mouser.com/Search/Refine.aspx?Keyword=538-90814-0204
C1-C102 C104 = passive components:CAPACITOR: ceramic capacitor
DEBUG1 DEBUG2 TP01 TP02 TP36 TP37 = C_Sager_Bibliothek:TP
IC1 IC4 IC5 IC8 IC16 = C_Sager_Bibliothek:OP275: Dual Very Low Noise Precision Operational Amplifier Source: http://www.analog.com/static/imported-files/data_sheets/OP270.pdf
IC2 IC3 = SPI:DAC084S085CIMM_NOPB: 8-Bit Micro Power QUAD Digital-to-Analog Converter with Rail-to-Rail Output Source: Datasheet <http://www.ti.com/general/docs/suppproductinfo.tsp?distId=10&gotoUrl=http://www.ti.com/lit/gpn/dac084s085>; MOUSER_PART_NUMBER: 926-DAC084S085CIMMNO
IC6 = NUCLEO_parts:LAN8742A-CZ-TR: Ethernet ICs Source: Datasheet <https://componentsearchengine.com/Datasheets/1/LAN8742A-CZ-TR.pdf>; DESCRIPTION: Ethernet ICs; HEIGHT: 1mm; MANUFACTURER_NAME: Microchip; MANUFACTURER_PART_NUMBER: LAN8742A-CZ-TR; MOUSER_PART_NUMBER: 579-LAN8742A-CZ-TR; MOUSER_PRICE-STOCK: https://www.mouser.com/Search/Refine.aspx?Keyword=579-LAN8742A-CZ-TR
IC7 IC9 IC14 IC15 = C_Sager_Bibliothek:TL072
IC10 = NUCLEO_parts:STM32F767ZIT6: STMICROELECTRONICS - STM32F767ZIT6 - MCU, 32BIT, CORTEX-M7, 216MHZ, LQFP-144 Source: Datasheet <https://componentsearchengine.com/Datasheets/1/STM32F767ZIT6.pdf>; DESCRIPTION: STMICROELECTRONICS - STM32F767ZIT6 - MCU, 32BIT, CORTEX-M7, 216MHZ, LQFP-144; HEIGHT: 1.6mm; MANUFACTURER_NAME: STMicroelectronics; MANUFACTURER_PART_NUMBER: STM32F767ZIT6; MOUSER_PART_NUMBER: 511-STM32F767ZIT6; MOUSER_PRICE-STOCK: https://www.mouser.com/Search/Refine.aspx?Keyword=511-STM32F767ZIT6
IC11 = C_Sager_Bibliothek:AD7606BSTZ: Bipolar Input, Simultaneous Sampling ADC Source: Datasheet <https://componentsearchengine.com/Datasheets/1/AD7606BSTZ.pdf>; DESCRIPTION: Bipolar Input, Simultaneous Sampling ADC; HEIGHT: 1.6mm; MANUFACTURER_NAME: Analog Devices; MANUFACTURER_PART_NUMBER: AD7606BSTZ; MOUSER_PART_NUMBER: 584-AD7606BSTZ; MOUSER_PRICE-STOCK: https://www.mouser.com/Search/Refine.aspx?Keyword=584-AD7606BSTZ
IC12 = NUCLEO_parts:ESDA6V1BC6: TVS Diode Array Bi-Directional ESDA6V1BC6 Quad, 80W, SOT-23 6-Pin Source: Datasheet <https://componentsearchengine.com/Datasheets/1/ESDA6V1BC6.pdf>; DESCRIPTION: TVS Diode Array Bi-Directional ESDA6V1BC6 Quad, 80W, SOT-23 6-Pin; HEIGHT: 1.45mm; MANUFACTURER_NAME: STMicroelectronics; MANUFACTURER_PART_NUMBER: ESDA6V1BC6; MOUSER_PART_NUMBER: 511-ESDA6V1BC6; MOUSER_PRICE-STOCK: https://www.mouser.com/Search/Refine.aspx?Keyword=511-ESDA6V1BC6
IC13 = NUCLEO_parts:USBLC6-4SC6: TVS Diode Array Uni-Directional USBLC6-4SC6 17V, SOT-23 6-Pin Source: Datasheet <https://componentsearchengine.com/Datasheets/1/USBLC6-4SC6.pdf>; DESCRIPTION: TVS Diode Array Uni-Directional USBLC6-4SC6 17V, SOT-23 6-Pin; HEIGHT: 1.45mm; MANUFACTURER_NAME: STMicroelectronics; MANUFACTURER_PART_NUMBER: USBLC6-4SC6; MOUSER_PART_NUMBER: 511-USBLC6-4SC6; MOUSER_PRICE-STOCK: https://www.mouser.com/Search/Refine.aspx?Keyword=511-USBLC6-4SC6
IN1(R/S) IN2(L/M) = C_Sager_Bibliothek:NEUTRIK_NC3FAH
IN_LEFT IN_RIGHT U4 U6-U8 = THAT_Library:THAT1240: Balanced Line Receiver THAT1240, THAT1243, THAT1246; MOUSER_PART_NUMBER: 887-1240S08-U
J1 = electro_mechanical:GWLEX-SMT-S988G_Y: SMT MODULAR JACK Source: Datasheet <https://componentsearchengine.com/Datasheets/1/GWLEX-SMT-S988G_Y.pdf>; DESCRIPTION: SMT MODULAR JACK; HEIGHT: 13.3mm; MANUFACTURER_NAME: Kycon; MANUFACTURER_PART_NUMBER: GWLEX-SMT-S988G/Y; MOUSER_PART_NUMBER: 806-GWLEX-SMT-S988GY; MOUSER_PRICE-STOCK: https://www.mouser.com/Search/Refine.aspx?Keyword=806-GWLEX-SMT-S988GY
K1-K4 K7 K8 = C_Sager_Bibliothek:RELAY_EE2-5NU: RELAY SPST
K5 K6 = C_Sager_Bibliothek:RELAY_EE2-5NU: RELAY SPST; SPICEPREFIX: B
OUT1(R/S) OUT2(L/M) = C_Sager_Bibliothek:NEUTRIK_NC3MAH
OUT_LEFT OUT_RIGHT = THAT_Library:THAT1646: Outsmarts Balanced Line Driver; MOUSER_PART_NUMBER: 887-1646S08-U
R1-R95 R97-R101 = passive components:RESISTOR: +/- 5 % resistor
S1 = NUCLEO_parts:PTS647SN50SMTR2LFS: Tactile Switches 50mA 12VDC, 1.0N 5.0mm H, G leads Source: Datasheet <https://www.ckswitches.com/media/2567/pts647.pdf>; DESCRIPTION: Tactile Switches 50mA 12VDC, 1.0N 5.0mm H, G leads; HEIGHT: 5mm; MANUFACTURER_NAME: C & K COMPONENTS; MANUFACTURER_PART_NUMBER: PTS647SN50SMTR2LFS; MOUSER_PART_NUMBER: 611-PTS647SN50SMTR2L; MOUSER_PRICE-STOCK: https://www.mouser.com/Search/Refine.aspx?Keyword=611-PTS647SN50SMTR2L
STAGE(LEFT) STAGE(RIGHT) VCA1(LEFT) VCA2(RIGHT) = THAT_Library:THAT2181: VCA Trimmable IC; MOUSER_PART_NUMBER: 887-2181CS08-U
T1 = NUCLEO_parts:H1102NL: PULSE ELECTRONICS - H1102NL - TRANSFORMER, 1:1, 1PORT, 100BASE-TX, SMT Source: Datasheet <https://componentsearchengine.com/Datasheets/1/H1102NL.pdf>; DESCRIPTION: PULSE ELECTRONICS - H1102NL - TRANSFORMER, 1:1, 1PORT, 100BASE-TX, SMT; HEIGHT: 5.97mm; MANUFACTURER_NAME: Pulse; MANUFACTURER_PART_NUMBER: H1102NL; MOUSER_PART_NUMBER: 673-H1102NL; MOUSER_PRICE-STOCK: https://www.mouser.com/Search/Refine.aspx?Keyword=673-H1102NL
U12 = C_Sager_Bibliothek:ULN2003
X1 = NUCLEO_parts:USB_B_CONNECTOR: BERG USB connector; MOUSER_PART_NUMBER: 649-61729-0010BLF
Y1 = NUCLEO_parts:NX3215SA-32.768K-STD-MUA-8: Crsytal unit for OA/AV/Mobile communications/Automotive Source: Datasheet <https://componentsearchengine.com/Datasheets/1/NX3215SA-32.768K-STD-MUA-8.pdf>; DESCRIPTION: Crsytal unit for OA/AV/Mobile communications/Automotive; HEIGHT: mm; MANUFACTURER_NAME: NDK; MANUFACTURER_PART_NUMBER: NX3215SA-32.768K-STD-MUA-8; MOUSER_PART_NUMBER: 344-NX3215SA32768K8; MOUSER_PRICE-STOCK: https://www.mouser.com/Search/Refine.aspx?Keyword=344-NX3215SA32768K8
Y2 = NUCLEO_parts:NX3225GD-8MHZ-STD-CRA-3: A small surface-mount type crystal unit, ideal for an engine control CPU clock; delivering the high reliability that is particularly demanded by automotive Source: Datasheet <https://componentsearchengine.com/Datasheets/1/NX3225GD-8MHZ-STD-CRA-3.pdf>; DESCRIPTION: A small surface-mount type crystal unit, ideal for an engine control CPU clock; delivering the high reliability that is particularly demanded by automotive; HEIGHT: 1mm; MANUFACTURER_NAME: NDK; MANUFACTURER_PART_NUMBER: NX3225GD-8MHZ-STD-CRA-3; MOUSER_PART_NUMBER: 344-NX3225GD8MCRA3; MOUSER_PRICE-STOCK: https://www.mouser.com/Search/Refine.aspx?Keyword=344-NX3225GD8MCRA3
Y3 = NUCLEO_parts:ABLS2-25.000MHZ-D4YF-T: ABRACON - ABLS2-25.000MHZ-D4YF-T - CRYSTAL, 25MHZ, 18PF, HC-49US Source: Datasheet <https://componentsearchengine.com/Datasheets/1/ABLS2-25.000MHZ-D4YF-T.pdf>; DESCRIPTION: ABRACON - ABLS2-25.000MHZ-D4YF-T - CRYSTAL, 25MHZ, 18PF, HC-49US; HEIGHT: mm; MANUFACTURER_NAME: ABRACON; MANUFACTURER_PART_NUMBER: ABLS2-25.000MHZ-D4YF-T; MOUSER_PART_NUMBER: 815-ABLS2-25-D4YF-T; MOUSER_PRICE-STOCK: https://www.mouser.com/Search/Refine.aspx?Keyword=815-ABLS2-25-D4YF-T
Z1 = passive components:ZENER_DIODE: Diodes Inc BZT52C2V0T-7 Zener Diode, 2.4V 5% 300 mW SMT 2-Pin SOD-523 Source: Datasheet <https://componentsearchengine.com/Datasheets/1/BZT52C2V0T-7.pdf>; DESCRIPTION: Diodes Inc BZT52C2V0T-7 Zener Diode, 2.4V 5% 300 mW SMT 2-Pin SOD-523; MOUSER_PART_NUMBER: 621-BZT52C2V0T-7